# EAGLE design ESP32_Final (EAGLE 9.3.0)
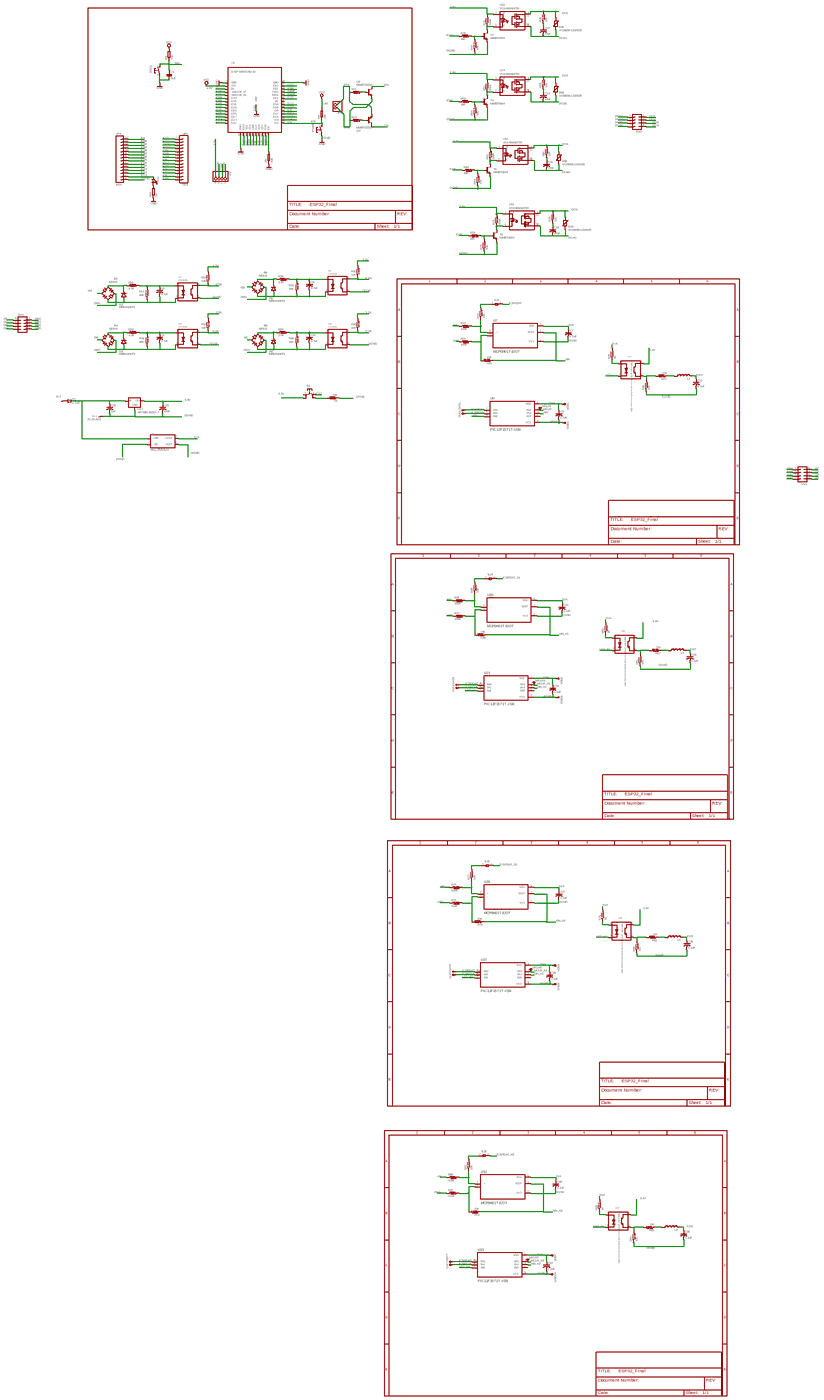
[diagram p0: schematic, sheet 1, overview]
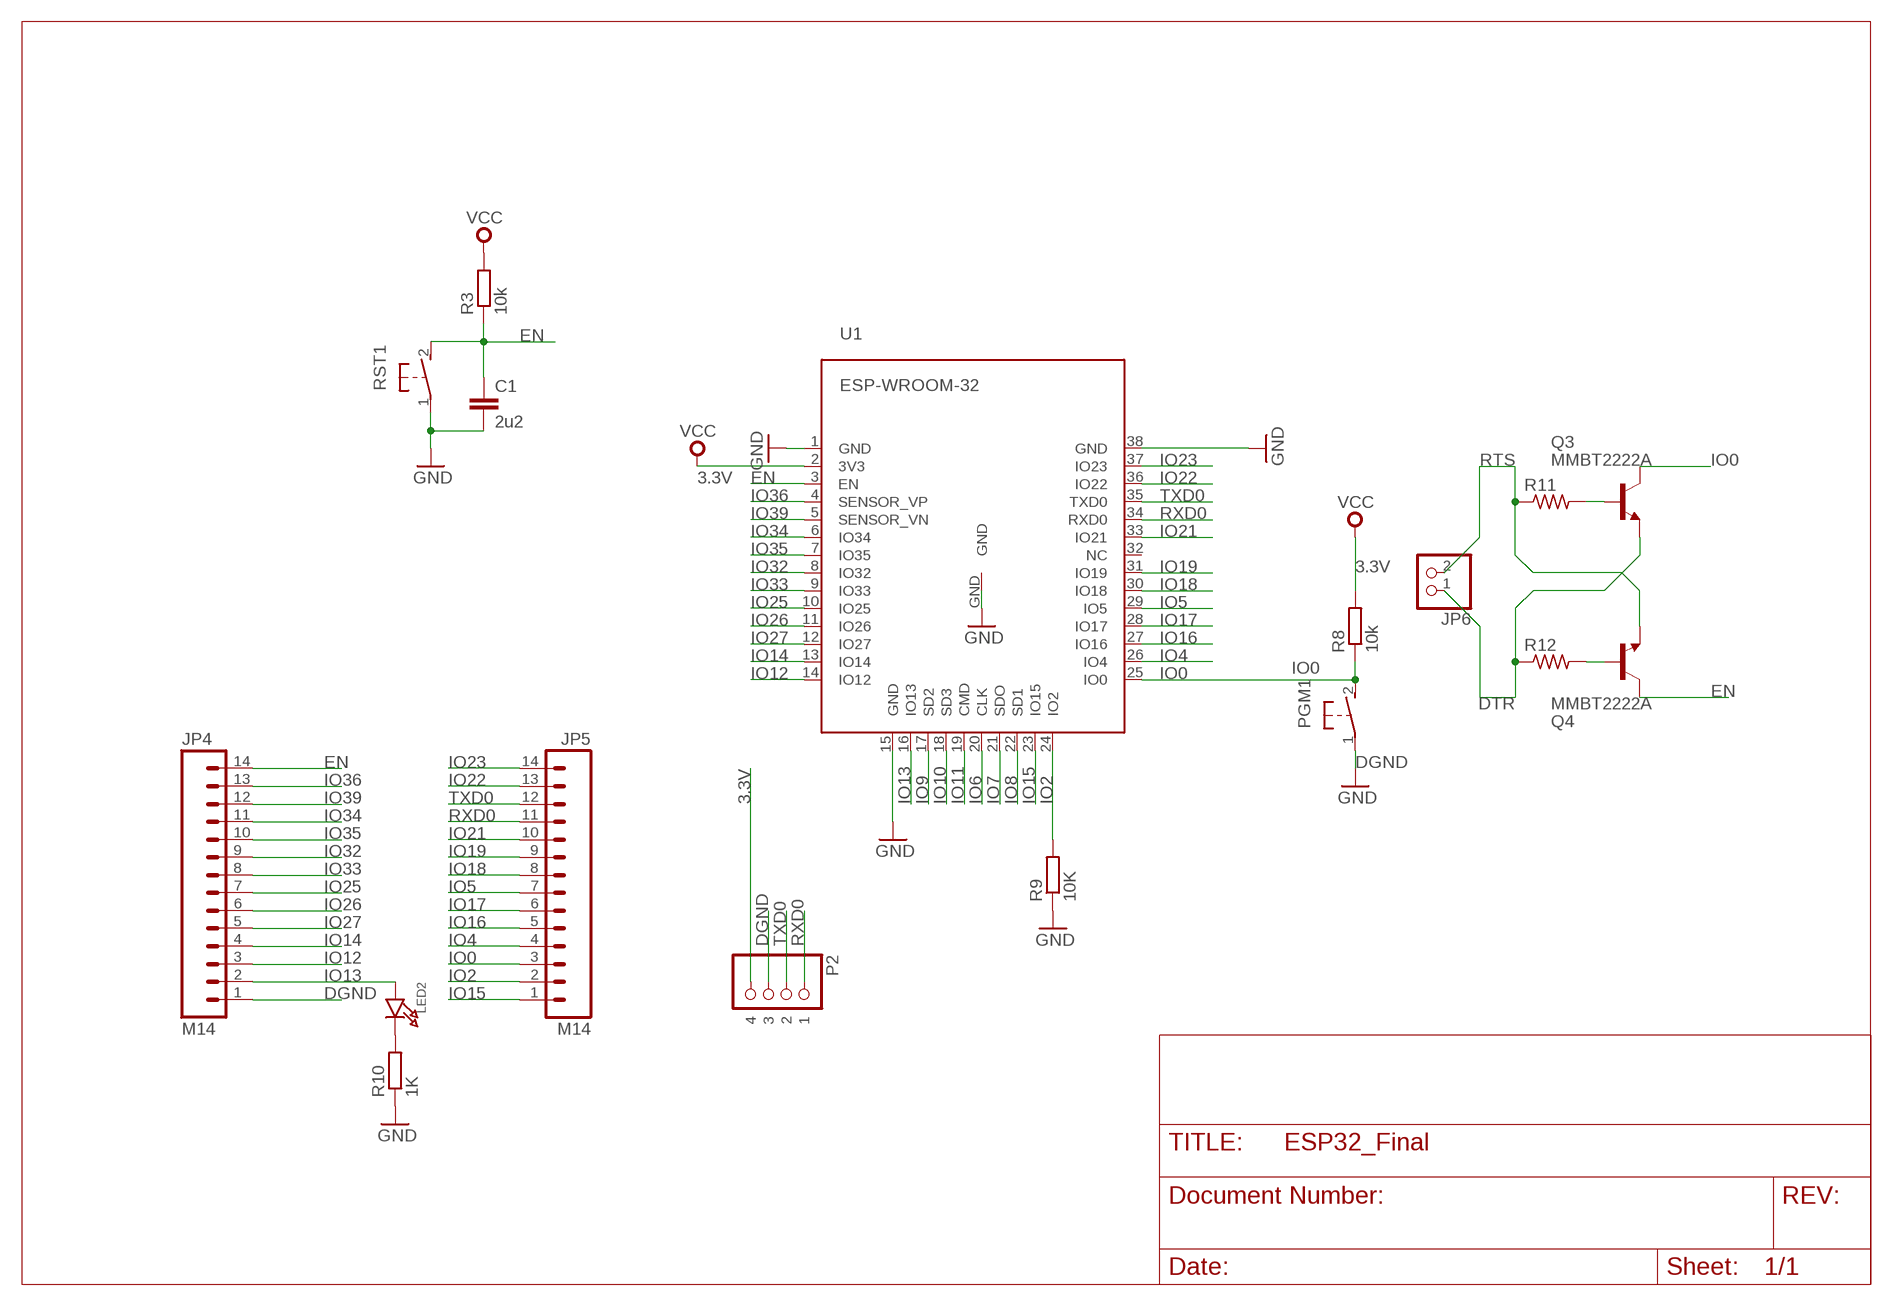
[diagram p1: schematic, sheet 1, part 1 of 5]
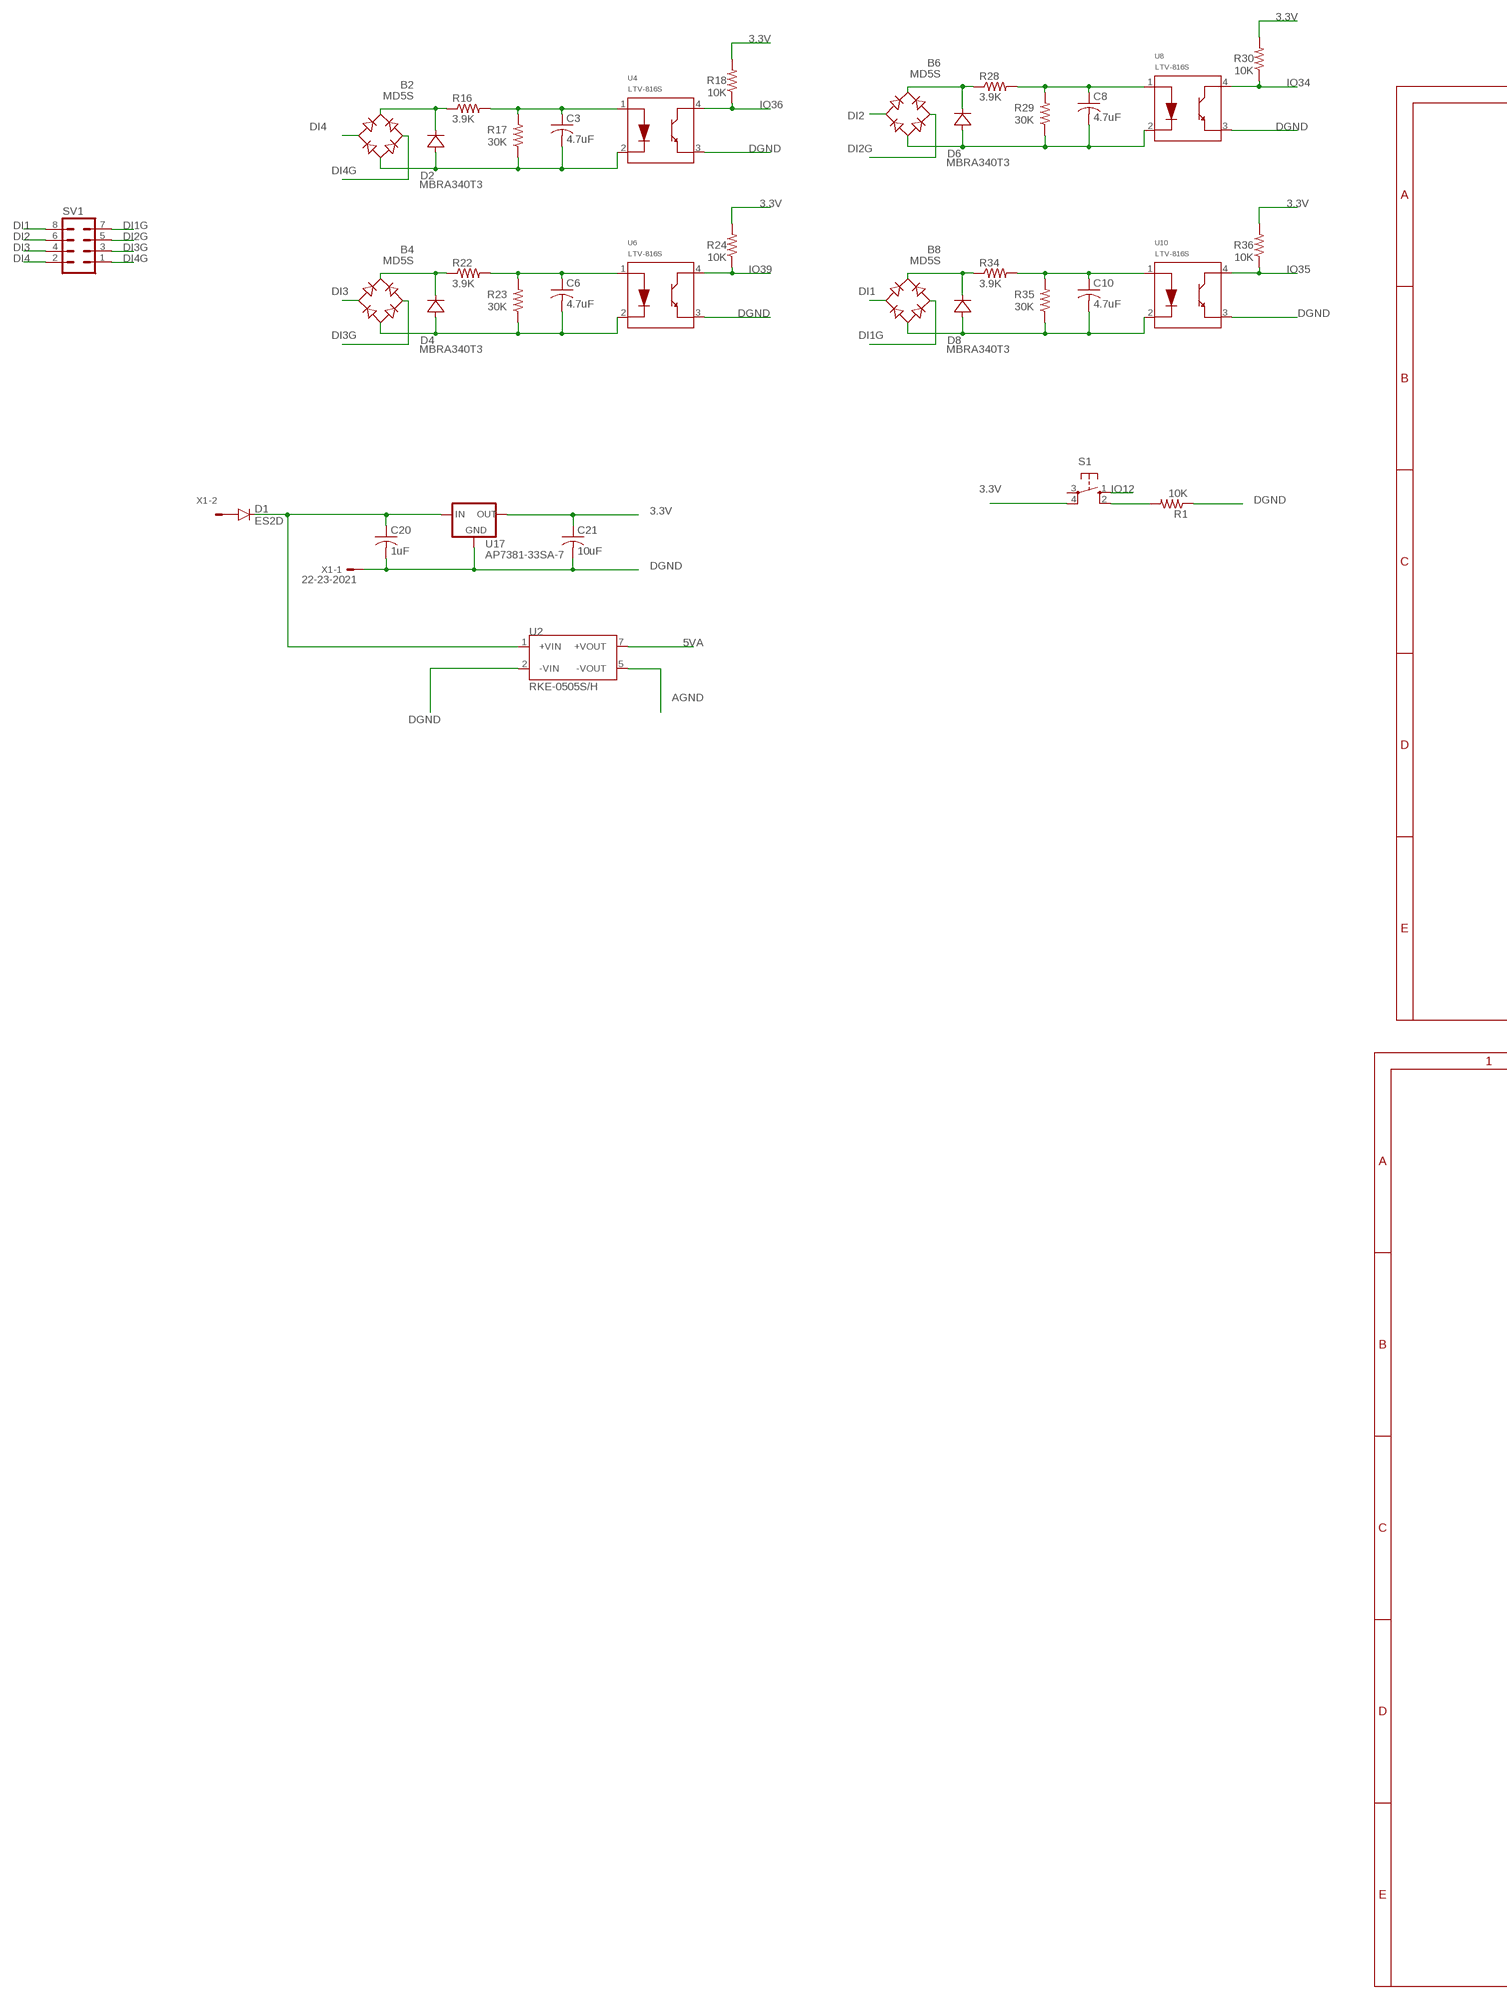
[diagram p2: schematic, sheet 1, part 2 of 5]
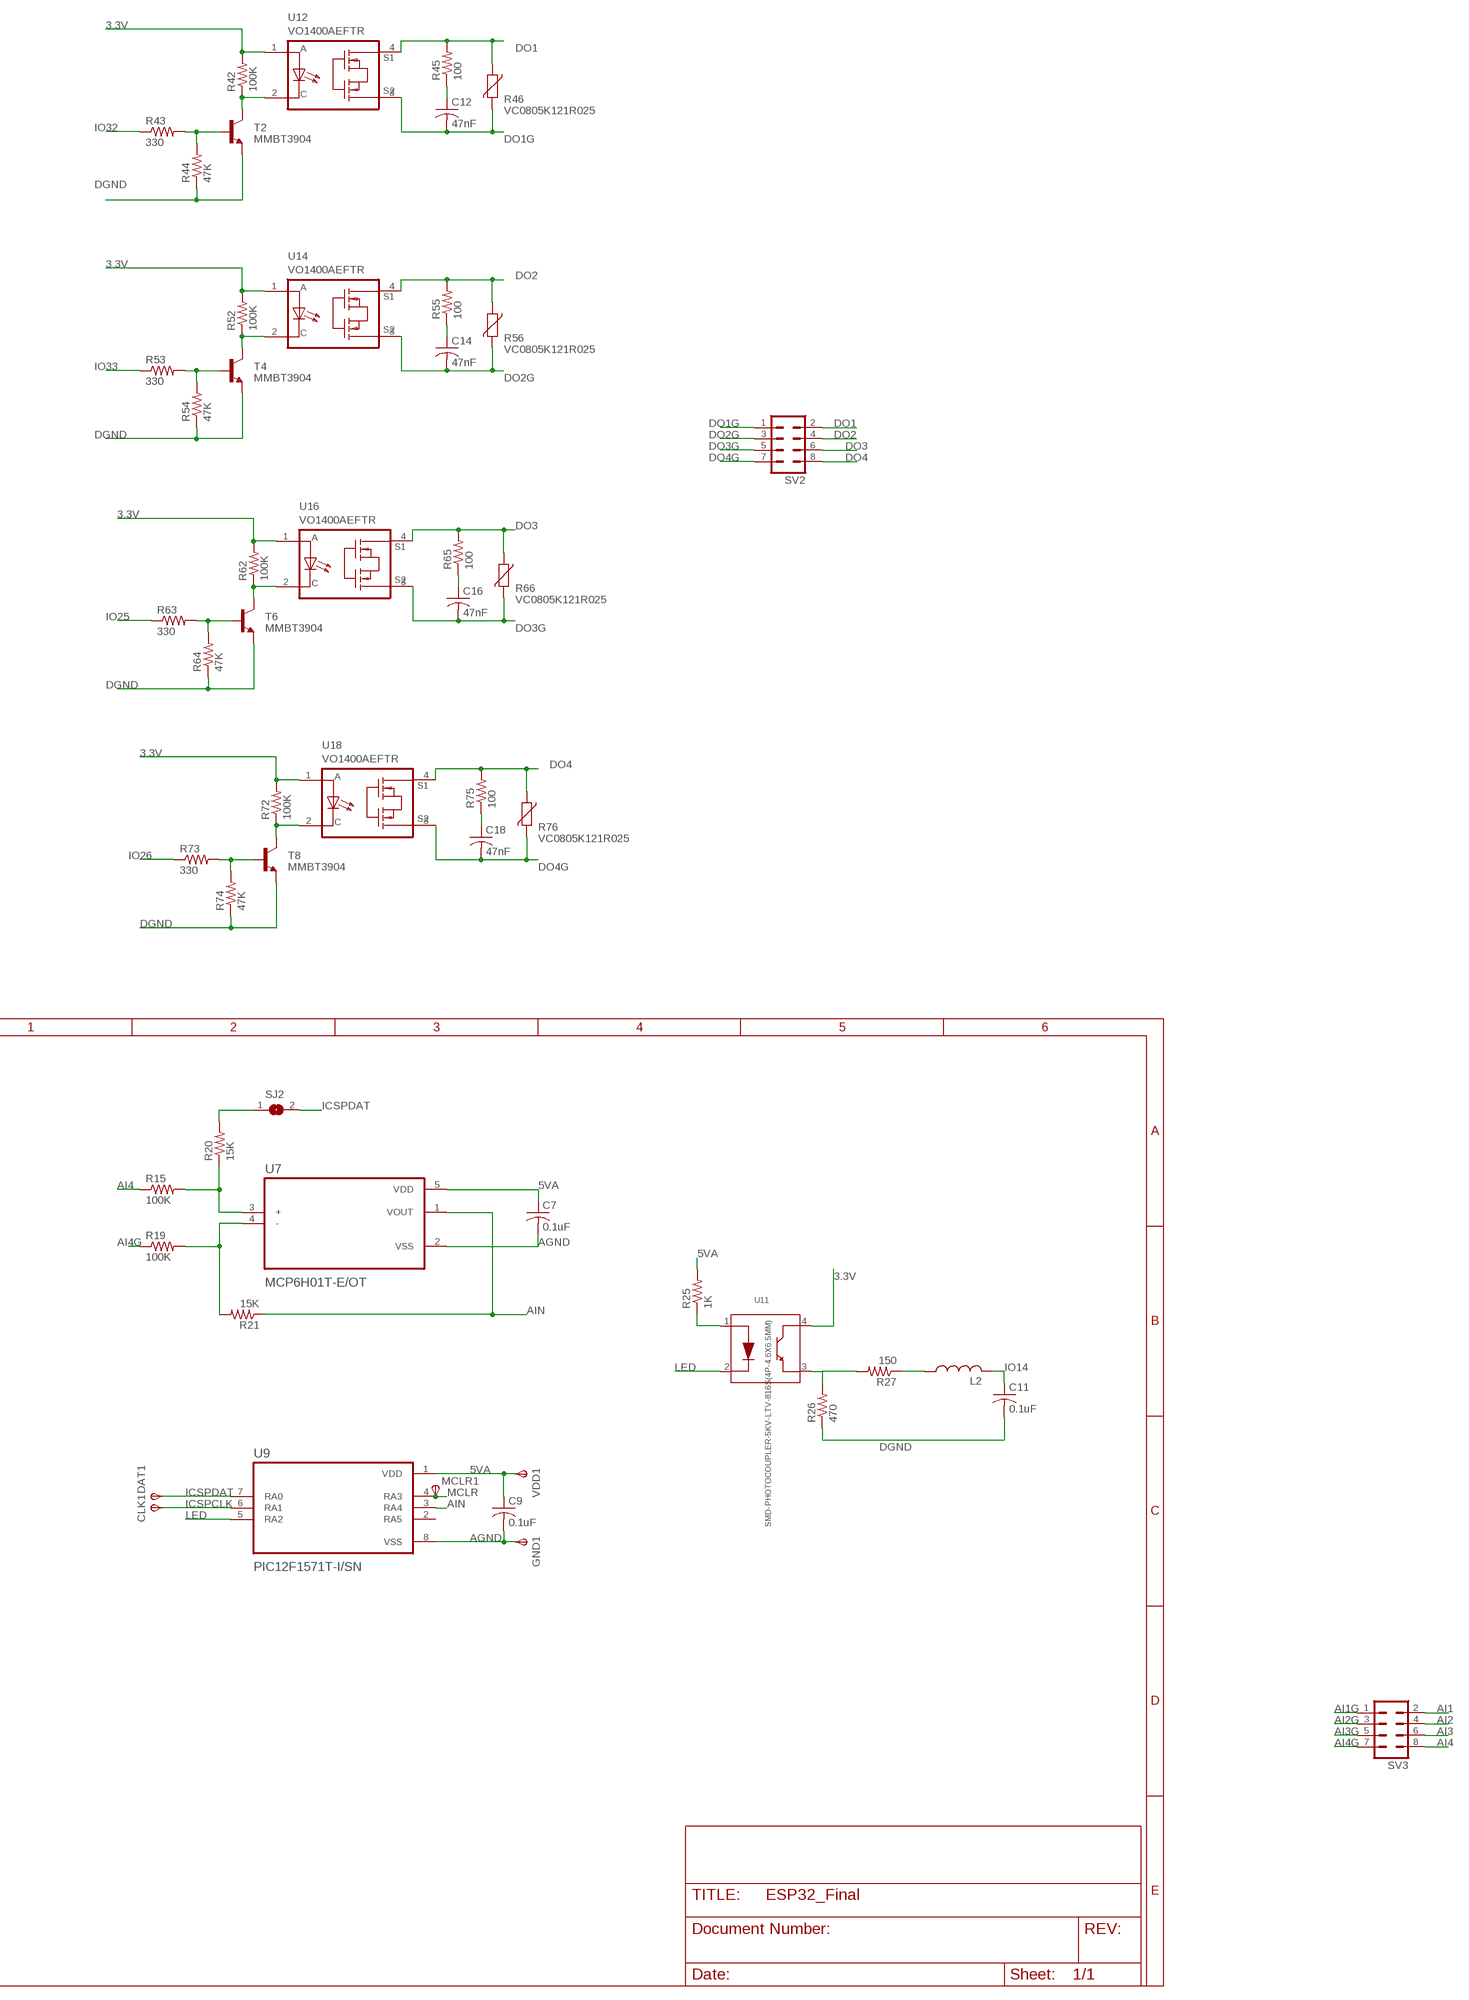
[diagram p3: schematic, sheet 1, part 3 of 5]
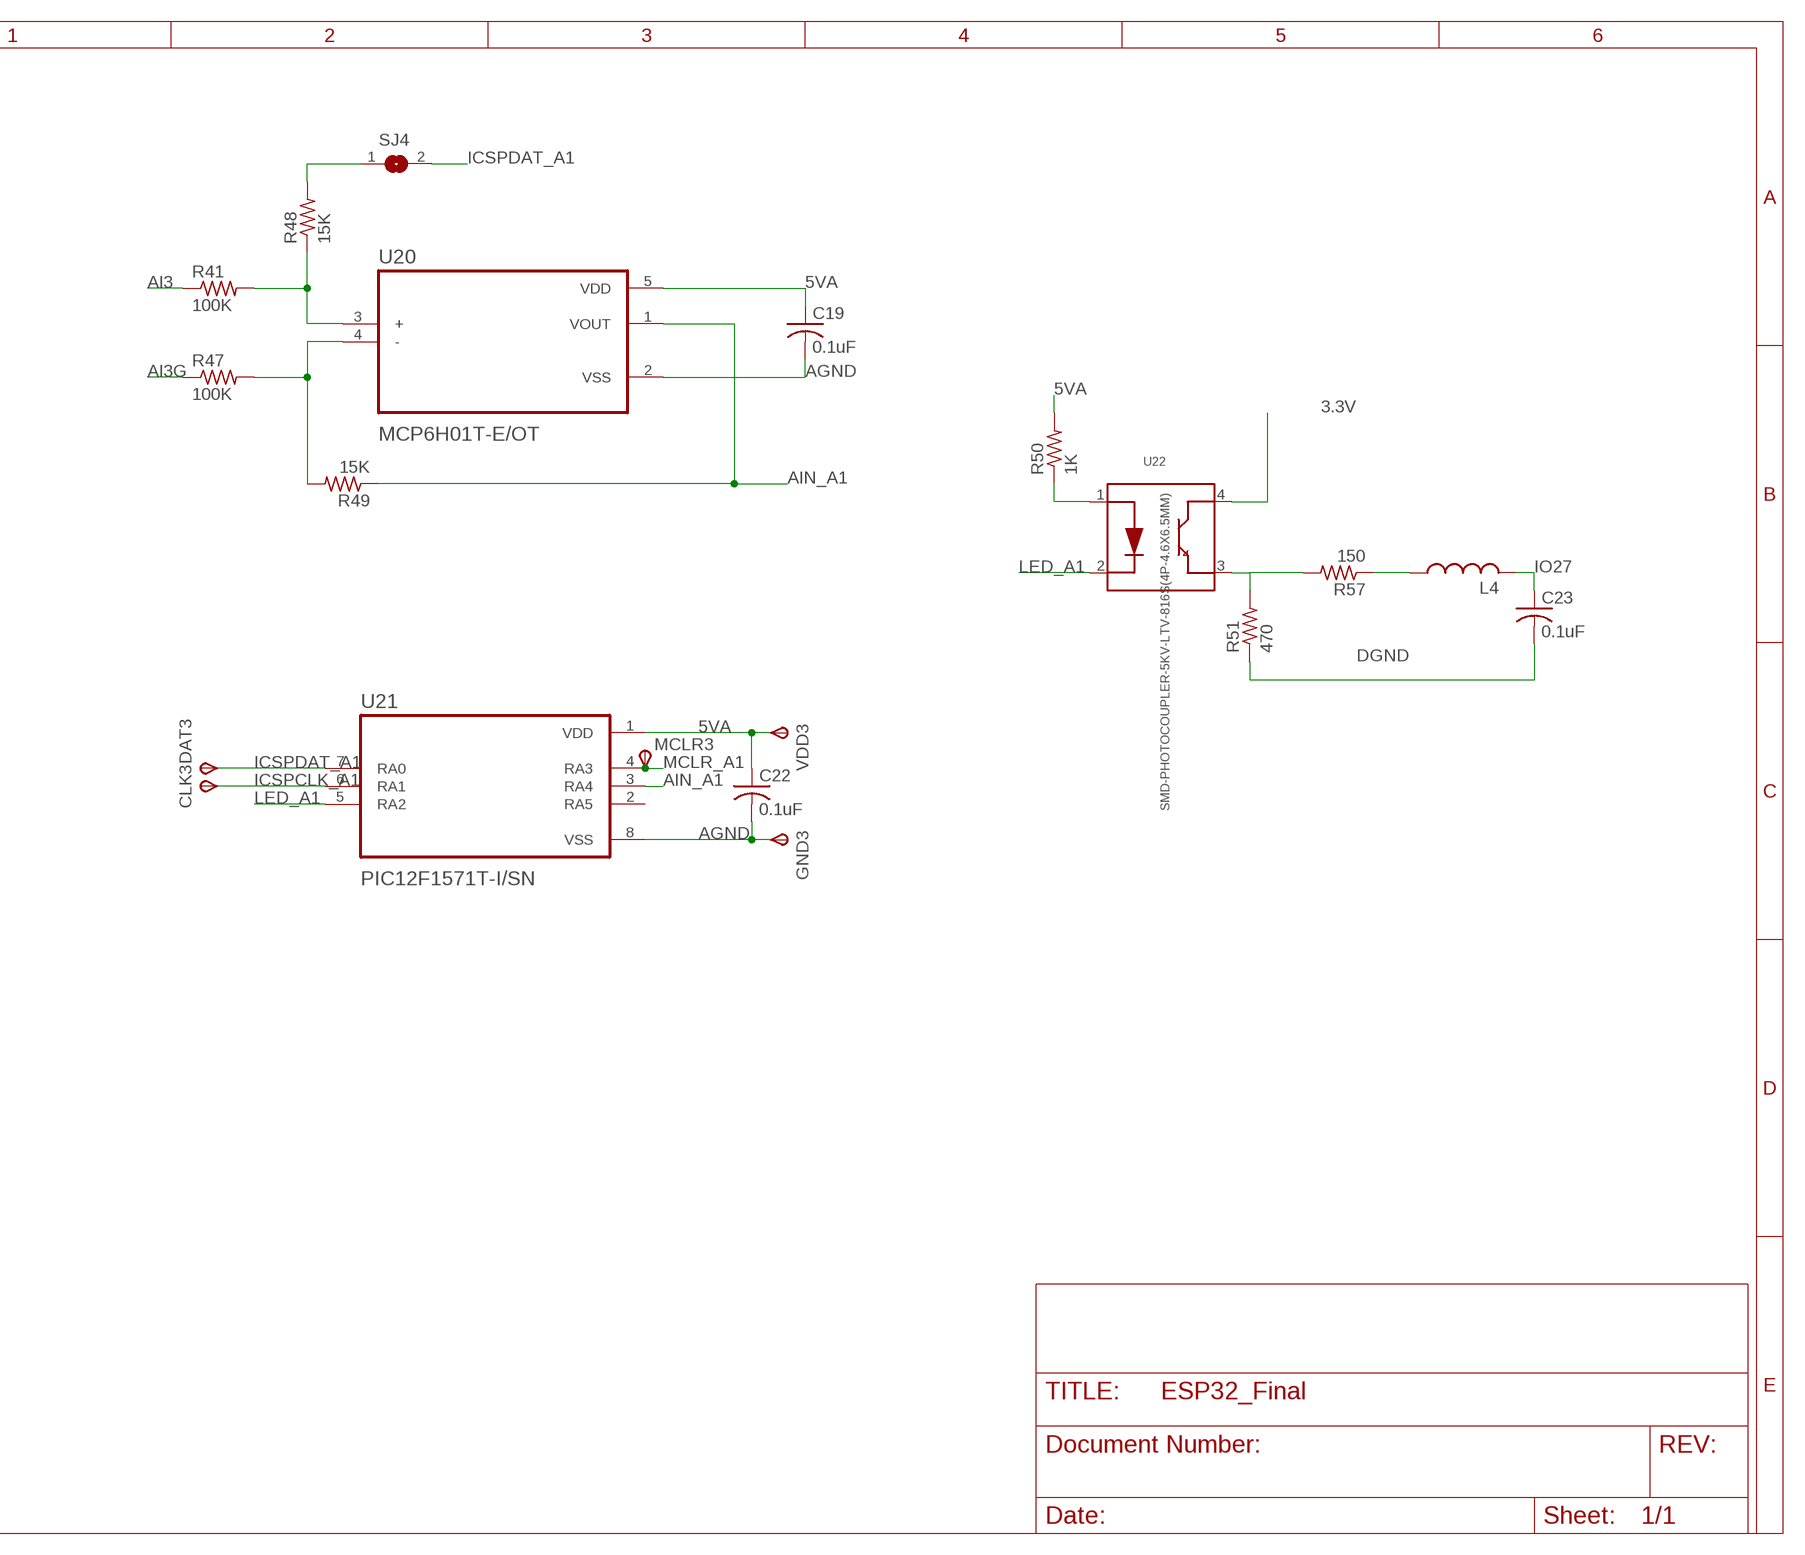
[diagram p4: schematic, sheet 1, part 4 of 5]
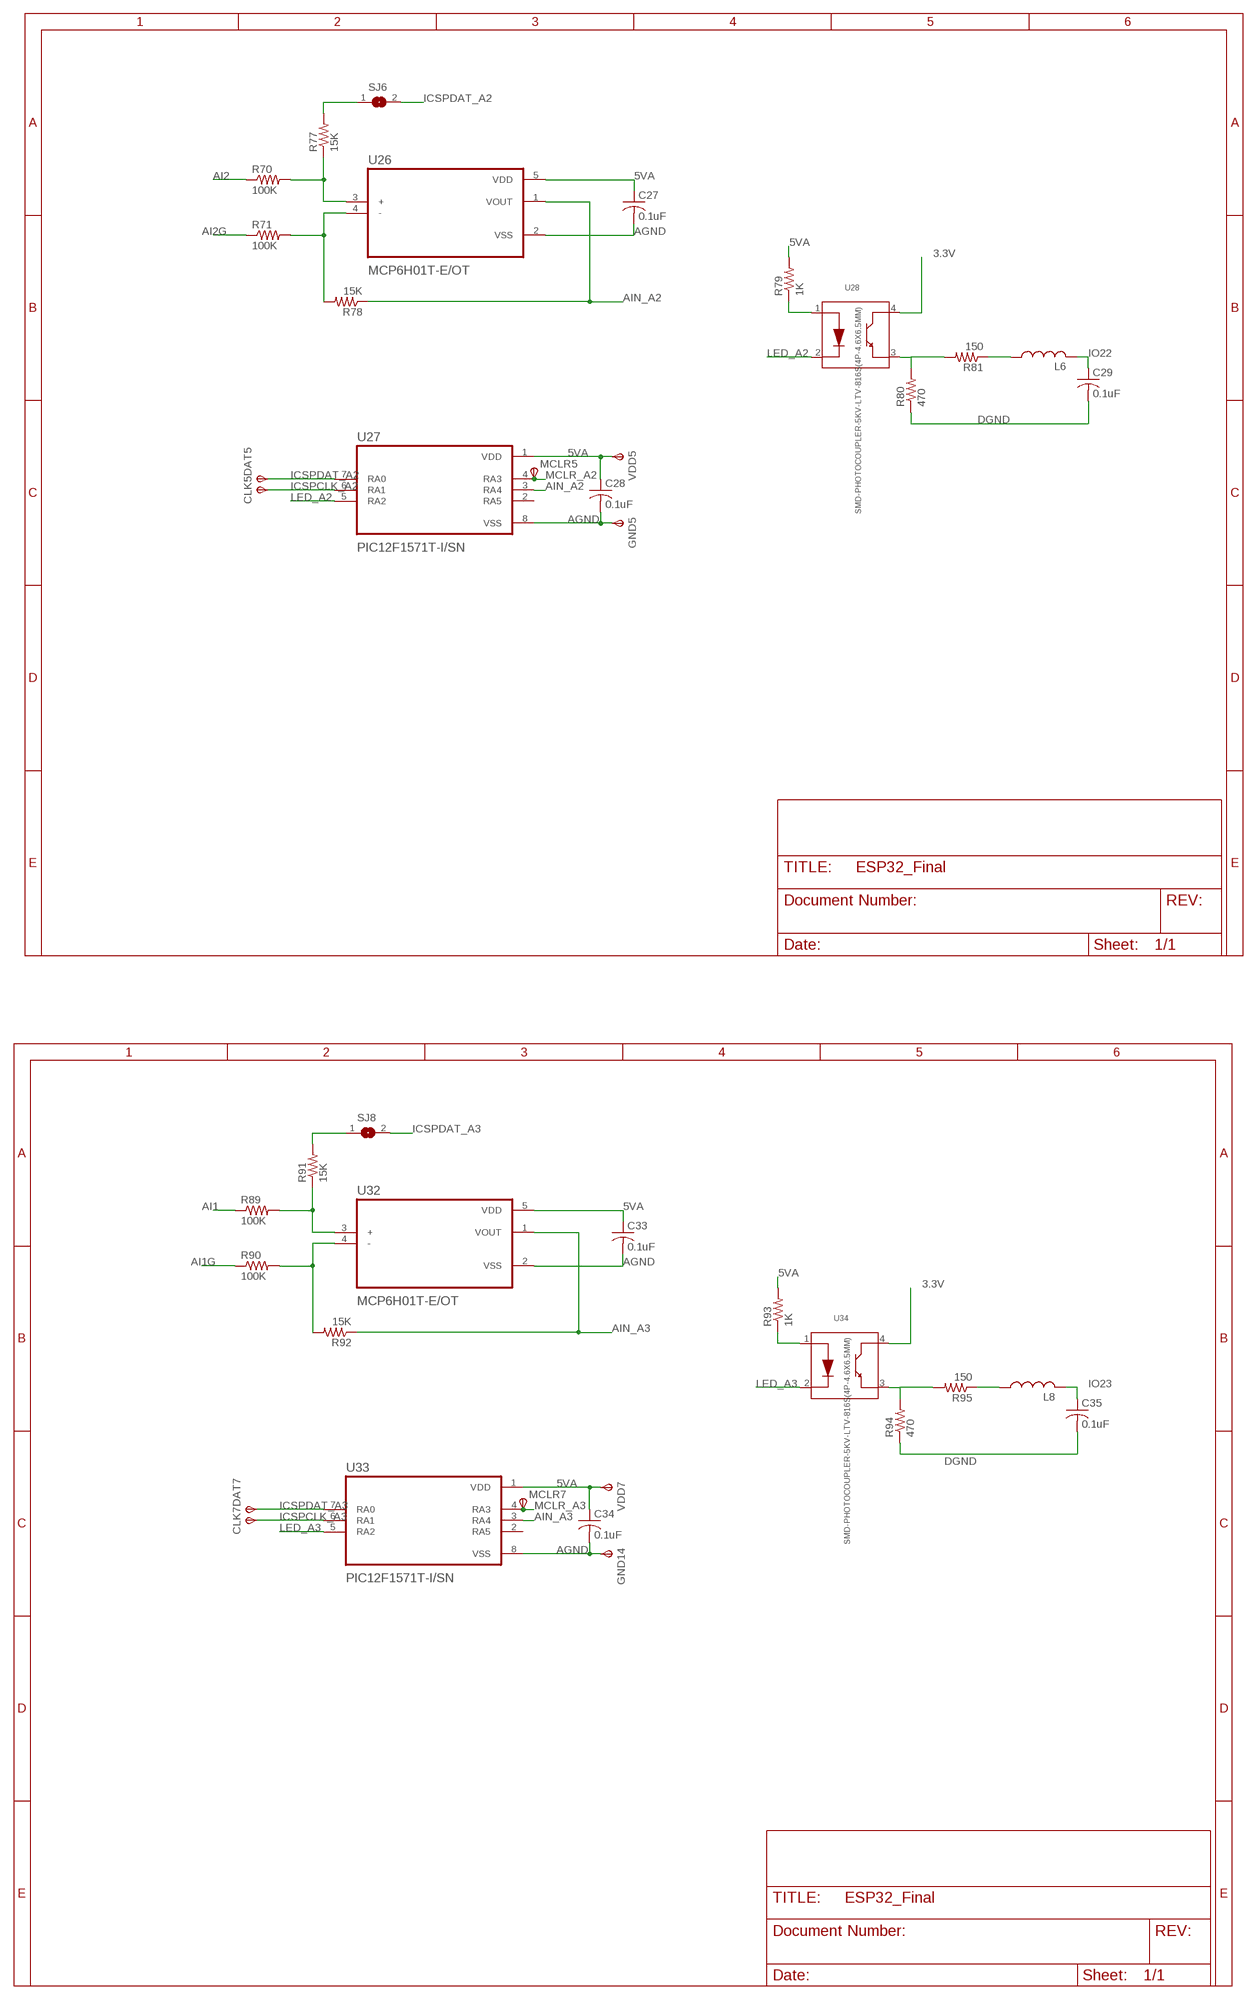
[diagram p5: schematic, sheet 1, part 5 of 5]

## Parts
B2  MD5S  RECTIFIER-S80  [TO-269AA]
B4  MD5S  RECTIFIER-S80  [TO-269AA]
B6  MD5S  RECTIFIER-S80  [TO-269AA]
B8  MD5S  RECTIFIER-S80  [TO-269AA]
C1  2u2  C-EUC0603  [C0603]
C3  4.7uF  C-USC0805  [C0805]
C6  4.7uF  C-USC0805  [C0805]
C7  0.1uF  C-USC0603  [C0603]
C8  4.7uF  C-USC0805  [C0805]
C9  0.1uF  C-USC0603  [C0603]
C10  4.7uF  C-USC0805  [C0805]
C11  0.1uF  C-USC0603  [C0603]
C12  47nF  C-USC0805  [C0805]
C14  47nF  C-USC0805  [C0805]
C16  47nF  C-USC0805  [C0805]
C18  47nF  C-USC0805  [C0805]
C19  0.1uF  C-USC0603  [C0603]
C20  1uF  C-USC0603  [C0603]
C21  10uF  C-USC0603  [C0603]
C22  0.1uF  C-USC0603  [C0603]
C23  0.1uF  C-USC0603  [C0603]
C27  0.1uF  C-USC0603  [C0603]
C28  0.1uF  C-USC0603  [C0603]
C29  0.1uF  C-USC0603  [C0603]
C33  0.1uF  C-USC0603  [C0603]
C34  0.1uF  C-USC0603  [C0603]
C35  0.1uF  C-USC0603  [C0603]
CLK1  TPSTP14R  [TP14R]
CLK3  TPSTP14R  [TP14R]
CLK5  TPSTP14R  [TP14R]
CLK7  TPSTP14R  [TP14R]
D1  ES2D  [SMB]
D2  MBRA340T3  [SMA]
D4  MBRA340T3  [SMA]
D6  MBRA340T3  [SMA]
D8  MBRA340T3  [SMA]
DAT1  TPSTP14R  [TP14R]
DAT3  TPSTP14R  [TP14R]
DAT5  TPSTP14R  [TP14R]
DAT7  TPSTP14R  [TP14R]
GND1  TPSTP14R  [TP14R]
GND3  TPSTP14R  [TP14R]
GND5  TPSTP14R  [TP14R]
GND14  TPSTP14R  [TP14R]
JP4  M14  [1X14]
JP5  M14  [1X14]
JP6  HEADER-1X2ROUND  [1X02_ROUND]
L2  L-USL2012C  [L2012C]
L4  L-USL2012C  [L2012C]
L6  L-USL2012C  [L2012C]
L8  L-USL2012C  [L2012C]
LED2  LED0603  [CHIPLED_0603]
MCLR1  TPSTP14R  [TP14R]
MCLR3  TPSTP14R  [TP14R]
MCLR5  TPSTP14R  [TP14R]
MCLR7  TPSTP14R  [TP14R]
P2  HEADER-1X4ROUND  [1X04_ROUND]
PGM1  DTSM-3  [DTSM-3]
Q3  MMBT2222A  [SOT23]
Q4  MMBT2222A  [SOT23]
R1  10K  R-US_R0805  [R0805]
R3  10k  R-EU_R0603  [R0603@1]
R8  10k  R-EU_R0603  [R0603@1]
R9  10K  R-EU_R0603  [R0603@1]
R10  1K  R-EU_R0603  [R0603@1]
R11  R-US_R0603  [R0603]
R12  R-US_R0603  [R0603]
R15  100K  R-US_R0805  [R0805]
R16  3.9K  R-US_R0805  [R0805]
R17  30K  R-US_R0805  [R0805]
R18  10K  R-US_R0603  [R0603]
R19  100K  R-US_R0805  [R0805]
R20  15K  R-US_R0603  [R0603]
R21  15K  R-US_R0603  [R0603]
R22  3.9K  R-US_R0805  [R0805]
R23  30K  R-US_R0805  [R0805]
R24  10K  R-US_R0603  [R0603]
R25  1K  R-US_R0805  [R0805]
R26  470  R-US_R0805  [R0805]
R27  150  R-US_R0805  [R0805]
R28  3.9K  R-US_R0805  [R0805]
R29  30K  R-US_R0805  [R0805]
R30  10K  R-US_R0603  [R0603]
R34  3.9K  R-US_R0805  [R0805]
R35  30K  R-US_R0805  [R0805]
R36  10K  R-US_R0603  [R0603]
R41  100K  R-US_R0805  [R0805]
R42  100K  R-US_R0603  [R0603]
R43  330  R-US_R0603  [R0603]
R44  47K  R-US_R0603  [R0603]
R45  100  R-US_R1210  [R1210]
R46  VC0805K121R025  VARISTORCN0805  [CT/CN0805]
R47  100K  R-US_R0805  [R0805]
R48  15K  R-US_R0603  [R0603]
R49  15K  R-US_R0603  [R0603]
R50  1K  R-US_R0805  [R0805]
R51  470  R-US_R0805  [R0805]
R52  100K  R-US_R0603  [R0603]
R53  330  R-US_R0603  [R0603]
R54  47K  R-US_R0603  [R0603]
R55  100  R-US_R1210  [R1210]
R56  VC0805K121R025  VARISTORCN0805  [CT/CN0805]
R57  150  R-US_R0805  [R0805]
R62  100K  R-US_R0603  [R0603]
R63  330  R-US_R0603  [R0603]
R64  47K  R-US_R0603  [R0603]
R65  100  R-US_R1210  [R1210]
R66  VC0805K121R025  VARISTORCN0805  [CT/CN0805]
R70  100K  R-US_R0805  [R0805]
R71  100K  R-US_R0805  [R0805]
R72  100K  R-US_R0603  [R0603]
R73  330  R-US_R0603  [R0603]
R74  47K  R-US_R0603  [R0603]
R75  100  R-US_R1210  [R1210]
R76  VC0805K121R025  VARISTORCN0805  [CT/CN0805]
R77  15K  R-US_R0603  [R0603]
R78  15K  R-US_R0603  [R0603]
R79  1K  R-US_R0805  [R0805]
R80  470  R-US_R0805  [R0805]
R81  150  R-US_R0805  [R0805]
R89  100K  R-US_R0805  [R0805]
R90  100K  R-US_R0805  [R0805]
R91  15K  R-US_R0603  [R0603]
R92  15K  R-US_R0603  [R0603]
R93  1K  R-US_R0805  [R0805]
R94  470  R-US_R0805  [R0805]
R95  150  R-US_R0805  [R0805]
RST1  DTSM-3  [DTSM-3]
S1  10-XX  [B3F-10XX]
SJ2  SJ  [SJ]
SJ4  SJ  [SJ]
SJ6  SJ  [SJ]
SJ8  SJ  [SJ]
SV1  MA04-2  [MA04-2]
SV2  MA04-2  [MA04-2]
SV3  MA04-2  [MA04-2]
T2  MMBT3904  MMBT3904LT1-NPN-SOT23-BEC  [SOT23-BEC]
T4  MMBT3904  MMBT3904LT1-NPN-SOT23-BEC  [SOT23-BEC]
T6  MMBT3904  MMBT3904LT1-NPN-SOT23-BEC  [SOT23-BEC]
T8  MMBT3904  MMBT3904LT1-NPN-SOT23-BEC  [SOT23-BEC]
U1  ESP-WROOM-32  [ESP-WROOM-32]
U2  RKE-0505S/H  [CONV_RKE-0505S/H]
U4  LTV-816S  SMD-PHOTOCOUPLER-5KV-LTV-816S(4P-4.6X6.5MM)  [SMD4-2.54-4.6X6.5MM]
U6  LTV-816S  SMD-PHOTOCOUPLER-5KV-LTV-816S(4P-4.6X6.5MM)  [SMD4-2.54-4.6X6.5MM]
U7  MCP6H01T-E/OT  [SOT95P280X145-5N]
U8  LTV-816S  SMD-PHOTOCOUPLER-5KV-LTV-816S(4P-4.6X6.5MM)  [SMD4-2.54-4.6X6.5MM]
U9  PIC12F1571T-I/SN  [SOIC127P600X175-8N]
U10  LTV-816S  SMD-PHOTOCOUPLER-5KV-LTV-816S(4P-4.6X6.5MM)  [SMD4-2.54-4.6X6.5MM]
U11  SMD-PHOTOCOUPLER-5KV-LTV-816S(4P-4.6X6.5MM)  [SMD4-2.54-4.6X6.5MM]
U12  VO1400AEFTR  [SOIC254P695X242-4N]
U14  VO1400AEFTR  [SOIC254P695X242-4N]
U16  VO1400AEFTR  [SOIC254P695X242-4N]
U17  AP7381-33SA-7  [SOT23]
U18  VO1400AEFTR  [SOIC254P695X242-4N]
U20  MCP6H01T-E/OT  [SOT95P280X145-5N]
U21  PIC12F1571T-I/SN  [SOIC127P600X175-8N]
U22  SMD-PHOTOCOUPLER-5KV-LTV-816S(4P-4.6X6.5MM)  [SMD4-2.54-4.6X6.5MM]
U26  MCP6H01T-E/OT  [SOT95P280X145-5N]
U27  PIC12F1571T-I/SN  [SOIC127P600X175-8N]
U28  SMD-PHOTOCOUPLER-5KV-LTV-816S(4P-4.6X6.5MM)  [SMD4-2.54-4.6X6.5MM]
U32  MCP6H01T-E/OT  [SOT95P280X145-5N]
U33  PIC12F1571T-I/SN  [SOIC127P600X175-8N]
U34  SMD-PHOTOCOUPLER-5KV-LTV-816S(4P-4.6X6.5MM)  [SMD4-2.54-4.6X6.5MM]
VDD1  TPSTP14R  [TP14R]
VDD3  TPSTP14R  [TP14R]
VDD5  TPSTP14R  [TP14R]
VDD7  TPSTP14R  [TP14R]
X1  22-23-2021  [22-23-2021]

## Nets
3.3V: C21.1 P2.4 R3.2 R8.2 R18.2 R24.2 R30.2 R36.2 R42.2 R52.2 R62.2 R72.2 S1.4(P1) U1.2(3V3) U11.4(COLLECTOR) U12.1(A) U14.1(A) U16.1(A) U17.2(OUT) U18.1(A) U22.4(COLLECTOR) U28.4(COLLECTOR) U34.4(COLLECTOR) ; supply symbol labelled VCC
5VA: C7.1 C9.1 C19.1 C22.1 C27.1 C28.1 C33.1 C34.1 R25.2 R50.2 R79.2 R93.2 U2.7(+VOUT) U7.5(VDD) U9.1(VDD) U20.5(VDD) U21.1(VDD) U26.5(VDD) U27.1(VDD) U32.5(VDD) U33.1(VDD) VDD1.TP(PP) VDD3.TP(PP) VDD5.TP(PP) VDD7.TP(PP)
AGND: C7.2 C9.2 C19.2 C22.2 C27.2 C28.2 C33.2 C34.2 GND1.TP(PP) GND3.TP(PP) GND5.TP(PP) GND14.TP(PP) U2.5(-VOUT) U7.2(VSS) U9.8(VSS) U20.2(VSS) U21.8(VSS) U26.2(VSS) U27.8(VSS) U32.2(VSS) U33.8(VSS)
AI1: R89.1 SV3.2
AI1G: R90.1 SV3.1
AI2: R70.1 SV3.4
AI2G: R71.1 SV3.3
AI3: R41.1 SV3.6
AI3G: R47.1 SV3.5
AI4: R15.1 SV3.8
AI4G: R19.1 SV3.7
AIN: R21.1 U7.1(VOUT) U9.3(RA4)
AIN_A1: R49.1 U20.1(VOUT) U21.3(RA4)
AIN_A2: R78.1 U26.1(VOUT) U27.3(RA4)
AIN_A3: R92.1 U32.1(VOUT) U33.3(RA4)
DGND: C1.2 C11.2 C20.2 C21.2 C23.2 C29.2 C35.2 JP4.1 P2.3 PGM1.1 R1.1 R9.1 R10.1 R26.1 R44.1 R51.1 R54.1 R64.1 R74.1 R80.1 R94.1 RST1.1 T2.E T4.E T6.E T8.E U1.1(GND) U1.15(GND) U1.38(GND) U1.GND U2.2(-VIN) U4.3(EMITER) U6.3(EMITER) U8.3(EMITER) U10.3(EMITER) U17.3(GND) X1.1 ; supply symbol labelled GND
DI1: B8.AC1 SV1.8
DI1G: B8.AC2 SV1.7
DI2: B6.AC1 SV1.6
DI2G: B6.AC2 SV1.5
DI3: B4.AC1 SV1.4
DI3G: B4.AC2 SV1.3
DI4: B2.AC1 SV1.2
DI4G: B2.AC2 SV1.1
DO1: R45.2 R46.1 SV2.2 U12.4(S1)
DO1G: C12.2 R46.2 SV2.1 U12.3(S2)
DO2: R55.2 R56.1 SV2.4 U14.4(S1)
DO2G: C14.2 R56.2 SV2.3 U14.3(S2)
DO3: R65.2 R66.1 SV2.6 U16.4(S1)
DO3G: C16.2 R66.2 SV2.5 U16.3(S2)
DO4: R75.2 R76.1 SV2.8 U18.4(S1)
DO4G: C18.2 R76.2 SV2.7 U18.3(S2)
DTR: JP6.1 Q3.2(E) R12.1
EN: C1.1 JP4.14 Q4.3(C) R3.1 RST1.2 U1.3(EN)
ICSPCLK: CLK1.TP(PP) U9.6(RA1)
ICSPCLK_A1: CLK3.TP(PP) U21.6(RA1)
ICSPCLK_A2: CLK5.TP(PP) U27.6(RA1)
ICSPCLK_A3: CLK7.TP(PP) U33.6(RA1)
ICSPDAT: DAT1.TP(PP) SJ2.2 U9.7(RA0)
ICSPDAT_A1: DAT3.TP(PP) SJ4.2 U21.7(RA0)
ICSPDAT_A2: DAT5.TP(PP) SJ6.2 U27.7(RA0)
ICSPDAT_A3: DAT7.TP(PP) SJ8.2 U33.7(RA0)
IO0: JP5.3 PGM1.2 Q3.3(C) R8.1 U1.25(IO0)
IO2: JP5.2 R9.2 U1.24(IO2)
IO4: JP5.4 U1.26(IO4)
IO5: JP5.7 U1.29(IO5)
IO6: U1.20(CLK)
IO7: U1.21(SDO)
IO8: U1.22(SD1)
IO9: U1.17(SD2)
IO10: U1.18(SD3)
IO11: U1.19(CMD)
IO12: JP4.3 S1.1(S) U1.14(IO12)
IO13: JP4.2 LED2.A U1.16(IO13)
IO14: C11.1 JP4.4 L2.2 U1.13(IO14)
IO15: JP5.1 U1.23(IO15)
IO16: JP5.5 U1.27(IO16)
IO17: JP5.6 U1.28(IO17)
IO18: JP5.8 U1.30(IO18)
IO19: JP5.9 U1.31(IO19)
IO21: JP5.10 U1.33(IO21)
IO22: C29.1 JP5.13 L6.2 U1.36(IO22)
IO23: C35.1 JP5.14 L8.2 U1.37(IO23)
IO25: JP4.7 R63.1 U1.10(IO25)
IO26: JP4.6 R73.1 U1.11(IO26)
IO27: C23.1 JP4.5 L4.2 U1.12(IO27)
IO32: JP4.9 R43.1 U1.8(IO32)
IO33: JP4.8 R53.1 U1.9(IO33)
IO34: JP4.11 R30.1 U1.6(IO34) U8.4(COLLECTOR)
IO35: JP4.10 R36.1 U1.7(IO35) U10.4(COLLECTOR)
IO36: JP4.13 R18.1 U1.4(SENSOR_VP) U4.4(COLLECTOR)
IO39: JP4.12 R24.1 U1.5(SENSOR_VN) U6.4(COLLECTOR)
LED: U9.5(RA2) U11.2(CATHODE)
LED_A1: U21.5(RA2) U22.2(CATHODE)
LED_A2: U27.5(RA2) U28.2(CATHODE)
LED_A3: U33.5(RA2) U34.2(CATHODE)
MCLR: MCLR1.TP(PP) U9.4(RA3)
MCLR_A1: MCLR3.TP(PP) U21.4(RA3)
MCLR_A2: MCLR5.TP(PP) U27.4(RA3)
MCLR_A3: MCLR7.TP(PP) U33.4(RA3)
N$1: LED2.C R10.2
N$2: D1.A X1.2
N$5: Q3.1(B) R11.2
N$6: Q4.1(B) R12.2
N$11: R1.2 S1.2(S1)
N$14: R15.2 R20.1 U7.3(+)
N$15: C3.1 R16.2 R17.2 U4.1(ANODE)
N$16: B2.- C3.2 D2.A R17.1 U4.2(CATHODE)
N$17: B2.+ D2.C R16.1
N$18: R19.2 R21.2 U7.4(-)
N$19: R20.2 SJ2.1
N$20: R25.1 U11.1(ANODE)
N$21: R26.2 R27.2 U11.3(EMITER)
N$24: L2.1 R27.1
N$31: C6.1 R22.2 R23.2 U6.1(ANODE)
N$32: B4.- C6.2 D4.A R23.1 U6.2(CATHODE)
N$33: B4.+ D4.C R22.1
N$40: R41.2 R48.1 U20.3(+)
N$41: R47.2 R49.2 U20.4(-)
N$42: R48.2 SJ4.1
N$43: R50.1 U22.1(ANODE)
N$44: R51.2 R57.2 U22.3(EMITER)
N$45: C20.1 D1.C U2.1(+VIN) U17.1(IN)
N$47: C8.1 R28.2 R29.2 U8.1(ANODE)
N$48: B6.- C8.2 D6.A R29.1 U8.2(CATHODE)
N$49: B6.+ D6.C R28.1
N$53: L4.1 R57.1
N$63: C10.1 R34.2 R35.2 U10.1(ANODE)
N$64: B8.- C10.2 D8.A R35.1 U10.2(CATHODE)
N$65: B8.+ D8.C R34.1
N$69: R70.2 R77.1 U26.3(+)
N$70: R71.2 R78.2 U26.4(-)
N$71: R77.2 SJ6.1
N$72: R79.1 U28.1(ANODE)
N$73: R80.2 R81.2 U28.3(EMITER)
N$76: L6.1 R81.1
N$80: R42.1 T2.C U12.2(C)
N$81: R43.2 R44.2 T2.B
N$85: C12.1 R45.1
N$92: R89.2 R91.1 U32.3(+)
N$93: R90.2 R92.2 U32.4(-)
N$94: R91.2 SJ8.1
N$95: R93.1 U34.1(ANODE)
N$96: R52.1 T4.C U14.2(C)
N$97: R53.2 R54.2 T4.B
N$98: R94.2 R95.2 U34.3(EMITER)
N$101: C14.1 R55.1
N$104: L8.1 R95.1
N$112: R62.1 T6.C U16.2(C)
N$113: R63.2 R64.2 T6.B
N$117: C16.1 R65.1
N$128: R72.1 T8.C U18.2(C)
N$129: R73.2 R74.2 T8.B
N$133: C18.1 R75.1
RTS: JP6.2 Q4.2(E) R11.1
RXD0: JP5.11 P2.1 U1.34(RXD0)
TXD0: JP5.12 P2.2 U1.35(TXD0)
Unconnected: S1.3(P) U1.32(NC) U9.2(RA5) U21.2(RA5) U27.2(RA5) U33.2(RA5)

## Library data of the parts
B2 B4 B6 B8 = rectifier:RECTIFIER-: Rectifier
C1 = rcl:C-EU: CAPACITOR, European symbol
C3 C6-C12 C14 C16 C18-C23 C27-C29 C33-C35 = rcl:C-US: CAPACITOR, American symbol; SPICEPREFIX: C
CLK1 CLK3 CLK5 CLK7 DAT1 DAT3 DAT5 DAT7 GND1 GND3 GND5 GND14 MCLR1 MCLR3 MCLR5 MCLR7 VDD1 VDD3 VDD5 VDD7 = testpad:TPS: TEST PIN
D1 = diode:ES2D: DIODE super fast rectifier, 2 A
D2 D4 D6 D8 = diode:MBRA340T3: Surface Mount Schottky Power Rectifier Source: http://www.onsemi.com/pub_link/Collateral/MBRA340T3-D.PDF
JP4 JP5 = SparkFun-Connectors:M14: Header 14 Standard 14-pin 0.1" header. Use with straight break away headers (SKU : PRT-00116), right angle break away headers (PRT-00553), swiss pins (PRT-00743), machine pins (PRT-00117), and female headers (PRT-00115).
JP6 = hari:HEADER-1X2: PIN HEADER
L2 L4 L6 L8 = rcl:L-US: INDUCTOR, American symbol; SPICEPREFIX: L
LED2 = hari:LED: LED 0603 - 0603 Surface Mount Package Green LED - Low Power (3.9mcd, 2ma, 1.7Vf) Orange LED - Low Power (9.8mcd, 2ma, 1.8Vf) Red LED - Low Power (5mcd, 2ma, 1.8Vf) Yellow LED - Low Power (7mcd, 2ma, 1.8Vf) 0805 - 0805 Surface Mount Package 20mA: Red LED (104mcd, 20mA, Diffused) - LS R976 [Digikey: 475-1278-6-ND] Red LED (12mcd, 20mA, 2.0Vf, Clear) - APT2012EC [Digikey: 754-1128-1-ND] Green LED (15mcd, 20mA, 2.2Vf, Clear) - APT2012GC [Digikey: 754-1131-1-ND] Orange LED (160mcd, 20mA, 2.1Vf, Clear) - APT2012SECK [Digikey: 754-1130-1-ND] 2mA: Red LED (8.8mcd, 2mA, 1.8Vf, Clear) - Low Power [Digikey: 475-2510-1-ND] Green LED (5mcd, 2mA, 1.8Vf, Clear) - Low Power [Digikey: 475-2730-1-ND] Yellow LED (11.3mcd, 2mA, 1.8Vf, Clear) - Low Power [Digikey: 475-2555-1-ND] 1206 - 1206 Surface Mount Package Green LED (26mcd, 20mA, Diffused) - LG N971 [Digikey: 475-1407-6-ND] Red LED (15mcd, 20mA, Diffused) - LH N974 [Digikey: 475-1416-6-ND]
P2 = hari:HEADER-1X4: PIN HEADER
PGM1 RST1 = switch-tact:DTSM-3
Q3 Q4 = MMBT2222A:MMBT2222A: 2N2222 General Purpose NPN Transistor; AVAILABILITY: Unavailable; MF: STMicroelectronics; MP: MMBT2222A; PACKAGE: TO-236-3 Taitron; PRICE: None
R1 R11 R12 R15-R17 R19-R23 R25-R29 R34 R35 R41-R45 R47-R55 R57 R62-R65 R70-R75 R77-R81 R89-R95 = rcl:R-US_: RESISTOR, American symbol; SPICEPREFIX: R
R3 R8-R10 = rcl:R-EU_: RESISTOR, European symbol
R18 R24 R30 R36 = rcl:R-US_: RESISTOR, American symbol
R46 R56 R66 R76 = varistor:VARISTOR: VARISTOR
S1 = switch-omron:10-XX: OMRON SWITCH; MPN: B3F-1000; OC_FARNELL: 176432; OC_NEWARK: 36M3542
SJ2 SJ4 SJ6 SJ8 = jumper:SJ: SMD solder JUMPER
SV1-SV3 = con-lstb:MA04-2: PIN HEADER; OC_FARNELL: unknown; OC_NEWARK: unknown
T2 T4 T6 T8 = transistor:*-NPN-: NPN Transistror BF959 corrected 2008.03.06
U1 = esp32:ESP-WROOM-32
U2 = RKE-0505S_H:RKE-0505S/H: Power Supply; DC-DC; 5V@0.2A; 4.5-5.5V In; Enclosed; PCB Mount; RKE-0505S/H Series; AVAILABILITY: Unavailable; DESCRIPTION: Power Supply; DC-DC; 5V@0.2A; 4.5-5.5V In; Enclosed; PCB Mount; RKE-0505S/H Series; MF: Recom Power; MP: RKE-0505S/H; PACKAGE: SIP-7 Recom Power; PRICE: None
U4 U6 U8 U10 U11 U22 U28 U34 = LTV-816S:SMD-PHOTOCOUPLER-5KV-LTV-816S(4P-4.6X6.5MM): 306060007; AVAILABILITY: Unavailable; DESCRIPTION: LTV Series Single Channel 80 V 5000 Vrms Transistor Output Optocoupler SMT-DIP-4; MF: Lite-On Inc.; MP: LTV-816S; PACKAGE: SMD-4 Lite-On; PRICE: None
U7 U20 U26 U32 = MCP6H01T-E_OT:MCP6H01T-E/OT: None; AVAILABILITY: Unavailable; DESCRIPTION: Operational amplifier; 1.2MHz; 3.5÷16VDC; Channels: 1; SOT23-5; MF: Microchip; MP: MCP6H01T-E/OT; PACKAGE: SOT-23 Microchip; PRICE: None
U9 U21 U27 U33 = PIC12F1571T-I_SN:PIC12F1571T-I/SN: None; AVAILABILITY: Unavailable; DESCRIPTION: PIC12F Series 1.75 kB Flash 128 Byte SRAM SMT 8-Bit Microcontroller - SOIC-8; MF: Microchip; MP: PIC12F1571T-I/SN; PACKAGE: SOIC-8 Microchip; PRICE: None
U12 U14 U16 U18 = VO1400AEFTR:VO1400AEFTR; AVAILABILITY: Unavailable; DESCRIPTION: VO1400 Series SPST 60 V 100 mA 5 Ohm 1 Form A Solid State Relay - SOIC-4; MF: Vishay; MP: VO1400AEFTR; PACKAGE: SOP-4 Vishay; PRICE: None
U17 = v-reg:AP7381-33SA-7
X1 = con-molex:22-23-2021: .100" (2.54mm) Center Header - 2 Pin; MF: MOLEX; MPN: 22-23-2021; OC_FARNELL: 1462926; OC_NEWARK: 25C3832

## Net classes
0 default: width 0.152 mm, drill 0.508 mm, clearance 0.254 mm
2 vcc: width 0.152 mm, drill 0.406 mm, clearance 0.254 mm

## Board
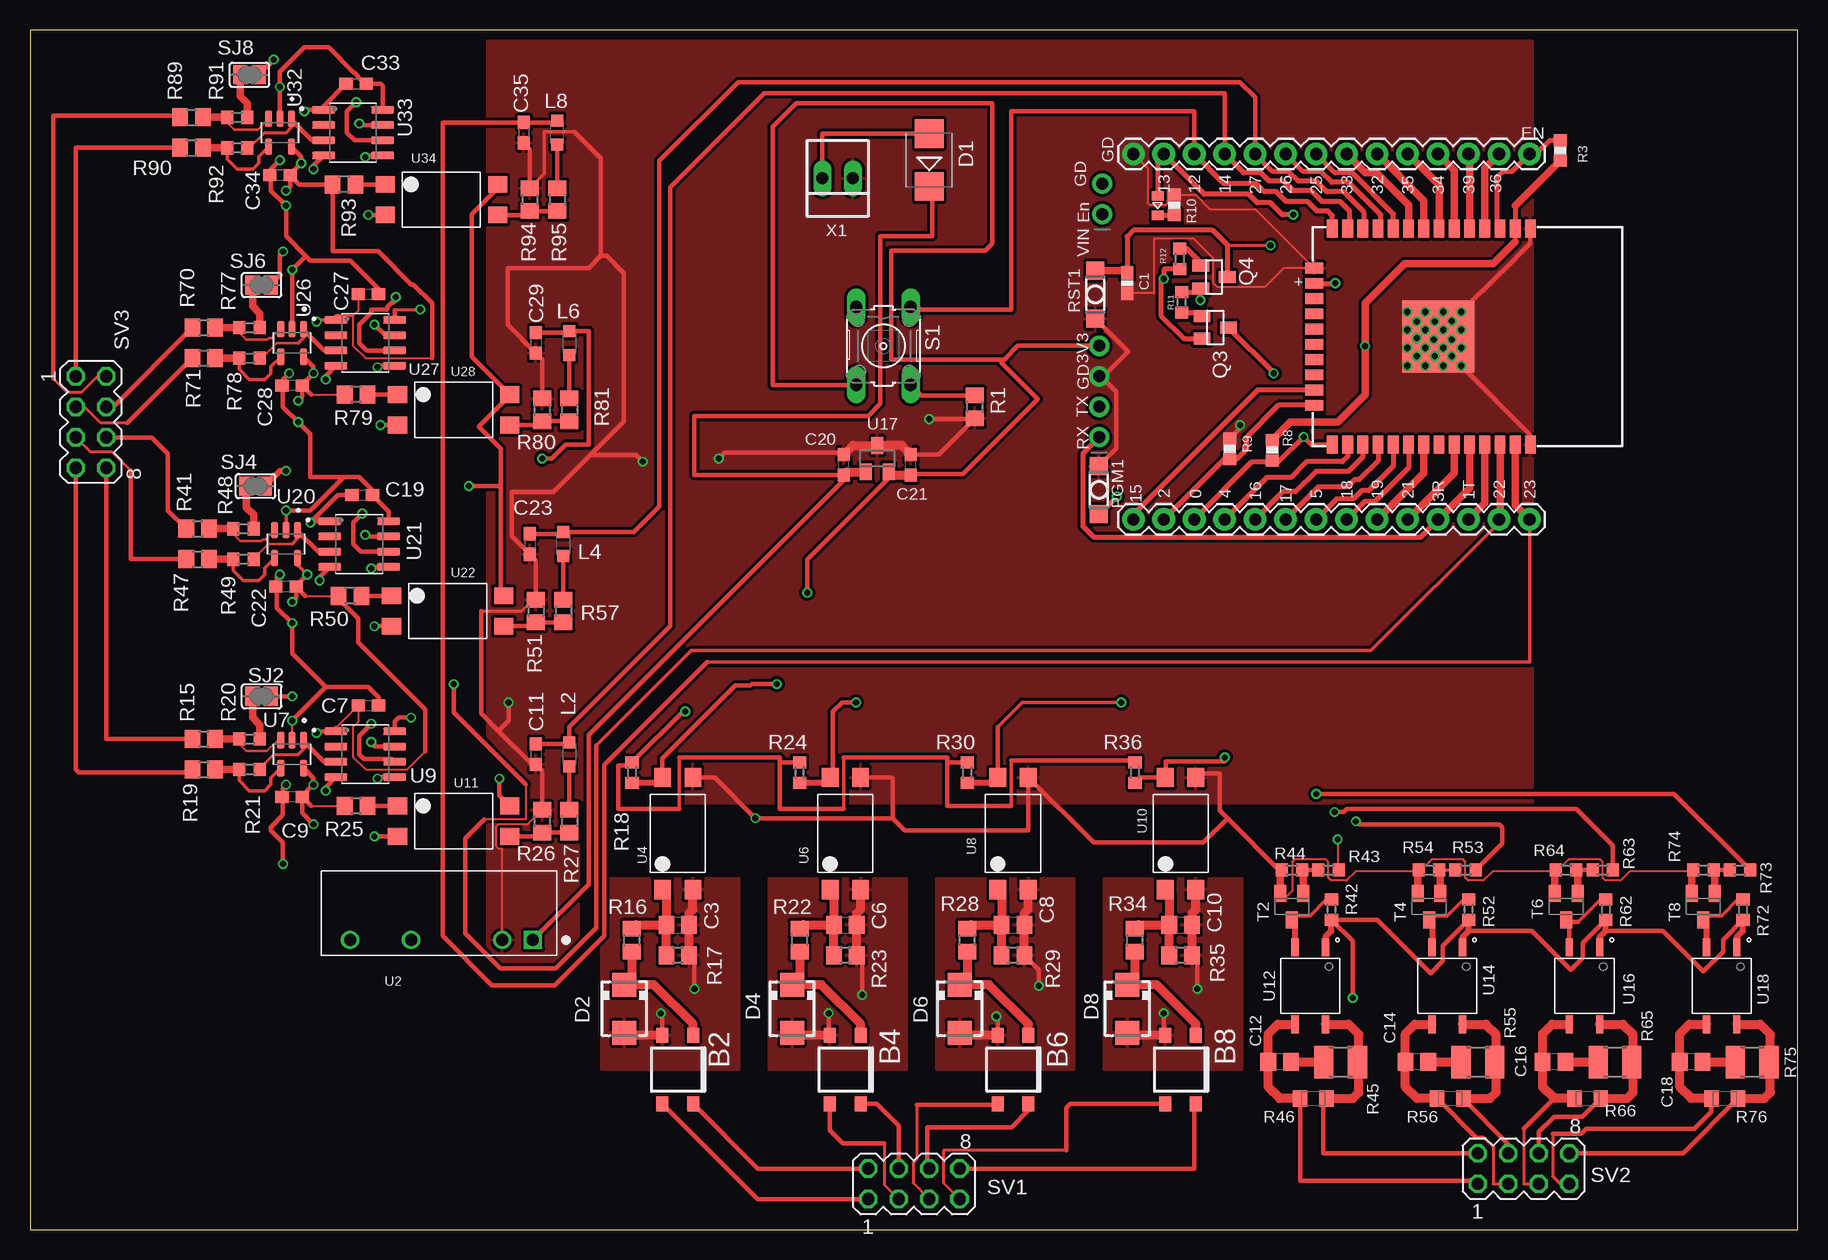
[diagram p6: board, top side]
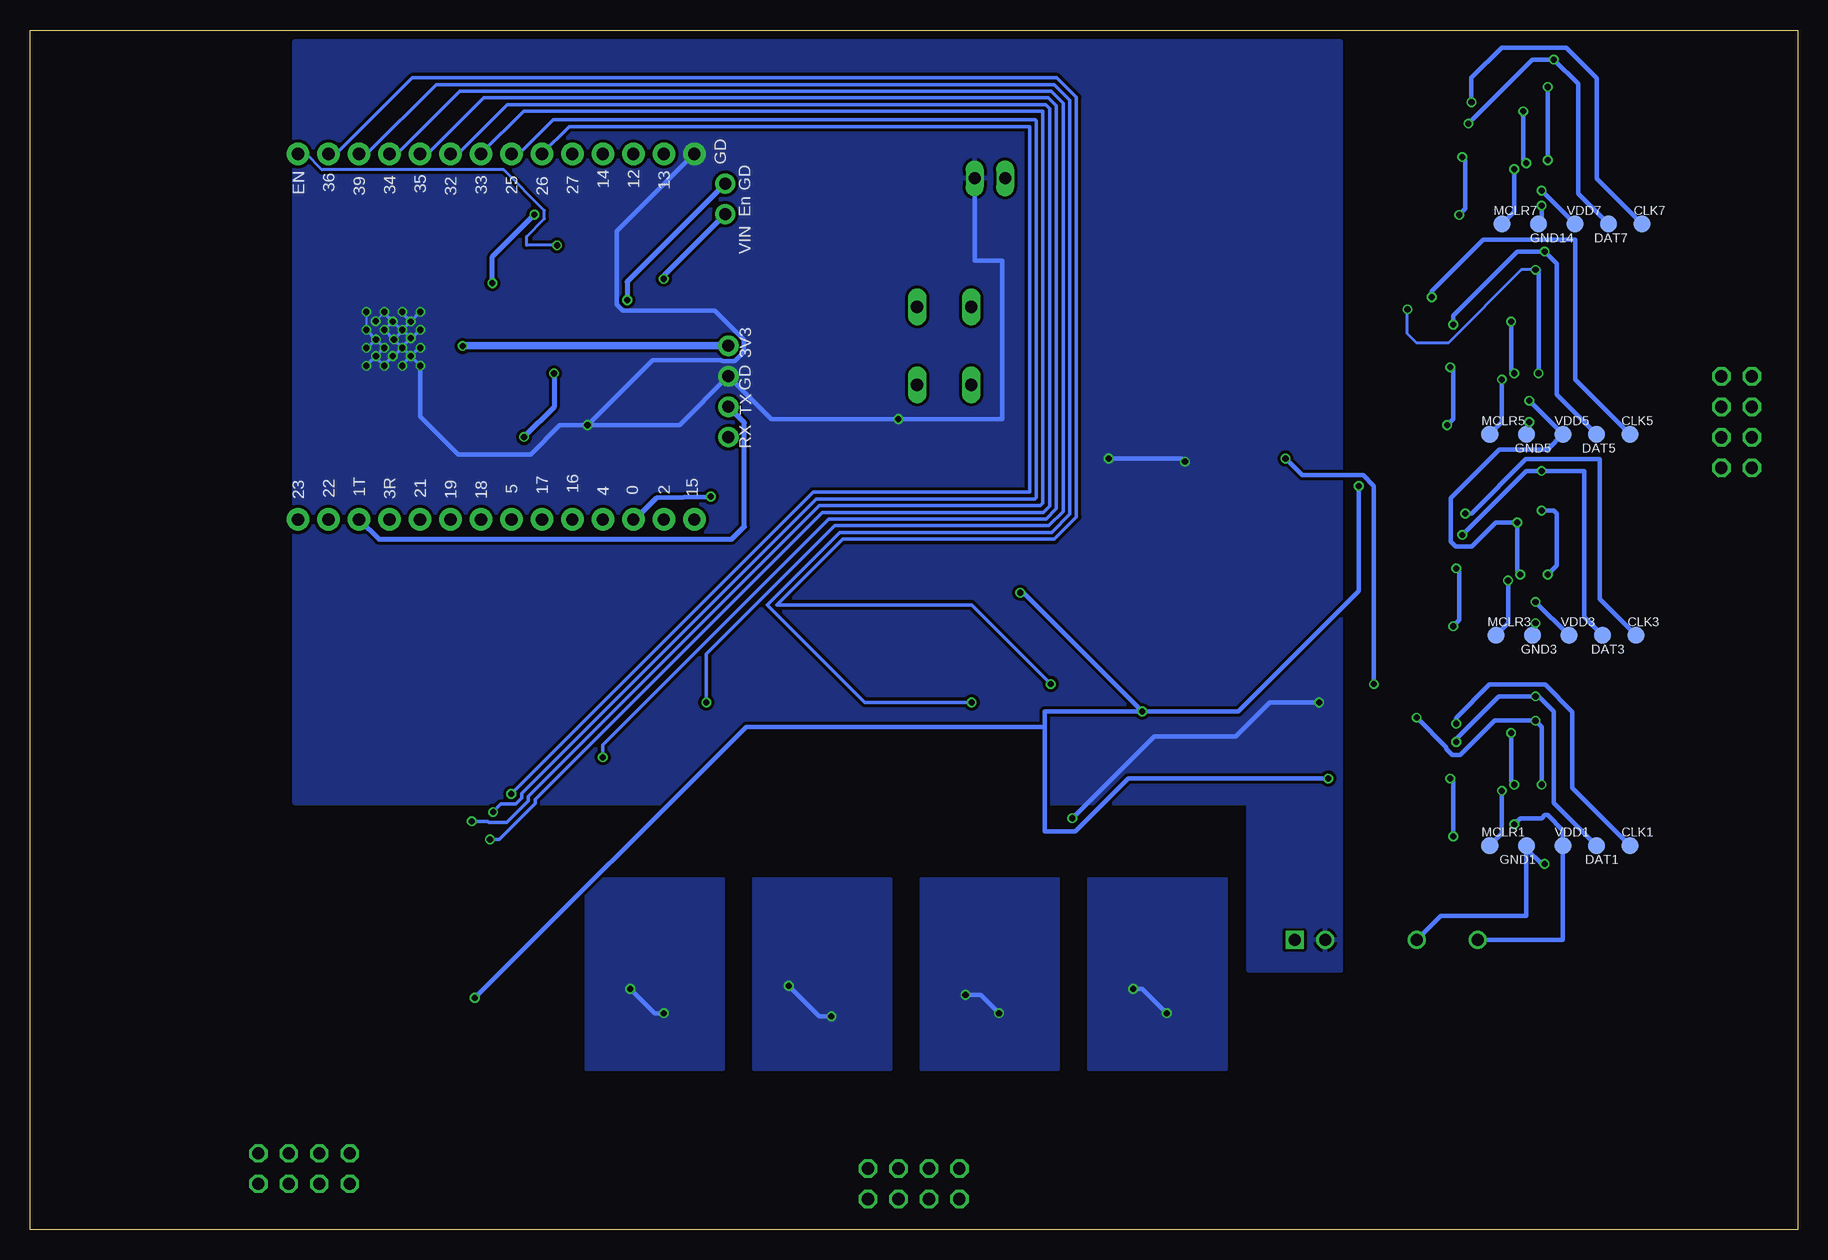
[diagram p7: board, bottom side, seen from below]

Size 147.3 x 100 mm. Coordinates in mm from the lower left corner, seen from the top.
Outline: 0,0 147.3,0 147.3,100 0,100 0,0
Copper layers (1*16): Top 0.035mm / dielectric 1.5mm / Bottom 0.035mm
Design rules "SeeedStudio_2layer_DRU_no_angle_20140221": minimum track width 6mil, minimum drill 12mil, track to track 6mil, track to pad 6mil, pad to pad 6mil, via to via 6mil, smd to smd 0mil, copper to edge 10mil, drill to drill 10mil, minimum pad ring 10mil, minimum via ring 6mil, stop-mask expansion 2mil, vias tented up to drill 100mil, thermal gap 10mil

### Footprints (pad centres in the part's own frame; a part is rotated, then mirrored left to right if it is on the bottom)
TO-269AA = smd 1 x 1.25: + -1.28,-2.855; - 1.28,-2.855; AC1 -1.28,2.855; AC2 1.28,2.855
C0603 = smd 1.1 x 1: 1 -0.85,0; 2 0.85,0
C0805 = smd 1.3 x 1.5: 1 -0.95,0; 2 0.95,0
TP14R = smd 1.4 x 1.4: TP 0,0
SMB = smd 2.4 x 2.4: A 2.2,0; C -2.2,0
SMA = smd 2 x 2: A 2,0; C -2,0
1X14 = drill 1.016 pad 1.88: 1 0,0; 2 2.54,0; 3 5.08,0; 4 7.62,0; 5 10.16,0; 6 12.7,0; 7 15.24,0; 8 17.78,0; 9 20.32,0; 10 22.86,0; 11 25.4,0; 12 27.94,0; 13 30.48,0; 14 33.02,0
1X02_ROUND = drill 1 pad 1.676: 1 -1.27,0; 2 1.27,0
L2012C = smd 1 x 1: 1 -1,0; 2 1,0
CHIPLED_0603 = smd 1.016 x 0.8: A 0,-0.75; C 0,0.85
1X04_ROUND = drill 1 pad 1.676: 1 -3.81,0; 2 -1.27,0; 3 1.27,0; 4 3.81,0
DTSM-3 = smd 1.5 x 1.5: 1 -2,0; 2 2,0
SOT23 = smd 1 x 1.4: 1 -0.95,-1.1; 2 0.95,-1.1; 3 0,1.1
R0805 = smd 1.3 x 1.5: 1 -0.95,0; 2 0.95,0
R0603@1 = smd 1 x 1.1: 1 -0.85,0; 2 0.85,0
R0603 = smd 1 x 1.1: 1 -0.85,0; 2 0.85,0
R1210 = smd 1.6 x 2.7: 1 -1.4,0; 2 1.4,0
CT/CN0805 = smd 1.2 x 1.4: 1 -1.1,0; 2 1.1,0
B3F-10XX = drill 1.016 long: 1 -3.251,2.261; 2 3.251,2.261; 3 -3.251,-2.261; 4 3.251,-2.261
SJ = smd 1.168 x 1.6: 1 -0.762,0; 2 0.762,0
MA04-2 = drill 1.016 octagon: 1 -3.81,-1.27; 2 -3.81,1.27; 3 -1.27,-1.27; 4 -1.27,1.27; 5 1.27,-1.27; 6 1.27,1.27; 7 3.81,-1.27; 8 3.81,1.27
SOT23-BEC = smd 1 x 1.4: B -0.95,-1.1; C 0,1.1; E 0.95,-1.1
ESP-WROOM-32 = smd 0.9 x 1.5: 1 7.7,9; 2 6.43,9; 3 5.16,9; 4 3.89,9; 5 2.62,9; 6 1.35,9; 7 0.08,9; 8 -1.19,9; 9 -2.46,9; 10 -3.73,9; 11 -5,9; 12 -6.27,9; 13 -7.54,9; 14 -8.81,9; 25 -8.81,-9; 26 -7.54,-9; 27 -6.27,-9; 28 -5,-9; 29 -3.73,-9; 30 -2.46,-9; 31 -1.19,-9; 32 0.08,-9; 33 1.35,-9; 34 2.62,-9; 35 3.89,-9; 36 5.16,-9; 37 6.43,-9; 38 7.7,-9 | smd 1.5 x 0.9: 15 -10.3,5.715; 16 -10.3,4.445; 17 -10.3,3.175; 18 -10.3,1.905; 19 -10.3,0.635; 20 -10.3,-0.635; 21 -10.3,-1.905; 22 -10.3,-3.175; 23 -10.3,-4.445; 24 -10.3,-5.715 | smd 6 x 6: GND 0,0
CONV_RKE-0505S/H = drill 1 square: 1 0,0 | drill 1: 2 2.54,0; 5 10.16,0; 7 15.24,0
SMD4-2.54-4.6X6.5MM = smd 1.4 x 1.6: 1 -1.27,-4.68; 2 1.27,-4.68; 3 1.27,4.68; 4 -1.27,4.68
SOT95P280X145-5N = smd 1.39 x 0.6: 1 -1.165,0.95; 2 -1.165,0; 3 -1.165,-0.95; 4 1.165,-0.95; 5 1.165,0.95
SOIC127P600X175-8N = smd 1.9 x 0.6: 1 -2.455,1.905; 2 -2.455,0.635; 3 -2.455,-0.635; 4 -2.455,-1.905; 5 2.455,-1.905; 6 2.455,-0.635; 7 2.455,0.635; 8 2.455,1.905
SOIC254P695X242-4N = smd 1.5 x 0.6: 1 -3.205,1.27; 2 -3.205,-1.27; 3 3.205,-1.27; 4 3.205,1.27
22-23-2021 = drill 1 long: 1 -1.27,0; 2 1.27,0

### Placement (x,y rotation side)
B2  53.98,13.34 180 top
B4  67.94,13.34 180 top
B6  81.92,13.34 180 top
B8  95.89,13.34 180 top
C1  91.43,78.89 270 top
C3  53.98,25.4 0 top
C6  67.94,25.4 0 top
C7  28.19,43.69 0 top
C8  81.92,25.4 0 top
C9  21.84,36.07 180 top
C10  95.89,25.4 0 top
C11  42.16,39.62 270 top
C12  104.14,13.97 180 top
C14  115.57,13.97 180 top
C16  127,13.97 180 top
C18  138.43,13.97 180 top
C19  27.69,61.21 0 top
C20  67.82,63.75 90 top
C21  73.41,63.75 90 top
C22  21.34,53.59 180 top
C23  41.66,57.15 270 top
C27  28.19,77.98 0 top
C28  21.84,70.36 180 top
C29  42.16,73.91 270 top
C33  27.18,95.5 0 top
C34  20.83,87.88 180 top
C35  41.15,91.44 270 top
CLK1  13.97,32 0 bottom
CLK3  13.46,49.53 0 bottom
CLK5  13.97,66.29 0 bottom
CLK7  12.95,83.82 0 bottom
D1  74.93,89.15 90 top
D2  49.53,18.41 270 top
D4  63.5,18.41 270 top
D6  77.47,18.41 270 top
D8  91.44,18.41 270 top
DAT1  16.76,32 0 bottom
DAT3  16.26,49.53 0 bottom
DAT5  16.76,66.29 0 bottom
DAT7  15.75,83.82 0 bottom
GND1  22.61,32 0 bottom
GND3  22.1,49.53 0 bottom
GND5  22.61,66.29 0 bottom
GND14  21.59,83.82 0 bottom
JP4  91.94,89.67 0 top
JP5  91.94,59.19 0 top
JP6  89.35,85.92 90 top
L2  44.96,39.62 90 top
L4  44.45,57.15 90 top
L6  44.96,73.91 90 top
L8  43.94,91.44 90 top
LED2  93.97,85.4 180 top
MCLR1  25.65,32 0 bottom
MCLR3  25.15,49.53 0 bottom
MCLR5  25.65,66.29 0 bottom
MCLR7  24.64,83.82 0 bottom
P2  89.09,69.86 90 top
PGM1  89.08,61.66 270 top
Q3  98.77,75.2 270 top
Q4  98.67,79.4 270 top
R1  78.74,68.58 90 top
R3  127.52,89.96 270 top
R8  103.53,64.97 90 top
R9  99.97,65.08 270 top
R10  95.36,85.4 270 top
R11  95.97,77.3 270 top
R12  95.81,80.91 90 top
R15  14.48,40.89 0 top
R16  50.16,24.13 90 top
R17  53.98,22.86 180 top
R18  50.16,38.1 90 top
R19  14.48,38.35 0 top
R20  18.29,40.89 0 top
R21  18.29,38.35 180 top
R22  64.14,24.13 90 top
R23  67.94,22.86 180 top
R24  64.14,38.1 90 top
R25  27.18,35.31 180 top
R26  42.67,34.04 270 top
R27  44.96,34.04 270 top
R28  78.11,24.13 90 top
R29  81.92,22.86 180 top
R30  78.11,38.1 90 top
R34  92.08,24.13 90 top
R35  95.89,22.86 180 top
R36  92.08,38.1 90 top
R41  13.97,58.42 0 top
R42  108.46,26.67 270 top
R43  108.2,29.97 180 top
R44  105.16,29.97 0 top
R45  109.22,13.97 0 top
R46  106.93,10.92 180 top
R47  13.97,55.88 0 top
R48  17.78,58.42 0 top
R49  17.78,55.88 180 top
R50  26.67,52.83 180 top
R51  42.16,51.56 270 top
R52  119.89,26.67 270 top
R53  119.63,29.97 180 top
R54  116.59,29.97 0 top
R55  120.65,13.97 0 top
R56  118.36,10.92 180 top
R57  44.45,51.56 270 top
R62  131.32,26.67 270 top
R63  131.06,29.97 180 top
R64  128.02,29.97 0 top
R65  132.08,13.97 0 top
R66  129.79,10.92 180 top
R70  14.48,75.18 0 top
R71  14.48,72.64 0 top
R72  142.75,26.67 270 top
R73  142.49,29.97 180 top
R74  139.45,29.97 0 top
R75  143.51,13.97 0 top
R76  141.22,10.92 180 top
R77  18.29,75.18 0 top
R78  18.29,72.64 180 top
R79  27.18,69.6 180 top
R80  42.67,68.33 270 top
R81  44.96,68.33 270 top
R89  13.46,92.71 0 top
R90  13.46,90.17 0 top
R91  17.27,92.71 0 top
R92  17.27,90.17 180 top
R93  26.16,87.12 180 top
R94  41.66,85.85 270 top
R95  43.94,85.85 270 top
RST1  88.77,77.96 90 top
S1  71.12,73.66 270 top
SJ2  19.3,44.45 0 top
SJ4  18.8,61.98 0 top
SJ6  19.3,78.74 0 top
SJ8  18.29,96.27 0 top
SV1  73.66,3.81 0 top
SV2  124.46,5.08 0 top
SV3  5.08,67.31 270 top
T2  105.16,26.92 180 top
T4  116.59,26.92 180 top
T6  128.02,26.92 180 top
T8  139.45,26.92 180 top
U1  117.34,74.43 0 top
U2  41.91,24.13 180 top
U4  53.98,33.02 0 top
U6  67.94,33.02 0 top
U7  21.84,39.62 270 top
U8  81.92,33.02 0 top
U9  27.94,39.62 0 top
U10  95.89,33.02 0 top
U11  35.31,34.04 270 top
U12  106.68,20.32 270 top
U14  118.11,20.32 270 top
U16  129.54,20.32 270 top
U17  70.61,64.26 0 top
U18  140.97,20.32 270 top
U20  21.34,57.15 270 top
U21  27.43,57.15 0 top
U22  34.8,51.56 270 top
U26  21.84,73.91 270 top
U27  27.94,73.91 0 top
U28  35.31,68.33 270 top
U32  20.83,91.44 270 top
U33  26.92,91.44 0 top
U34  34.29,85.85 270 top
VDD1  19.56,32 0 bottom
VDD3  19.05,49.53 0 bottom
VDD5  19.56,66.29 0 bottom
VDD7  18.54,83.82 0 bottom
X1  67.31,87.63 180 top

### Tracks (layer width: path | path; a pad name or v marks a point on that pad's centre or on a via)
3.3V  (via drill 0.51)
  Top 0.152: R36.2 91.91,39.12 | 76.45,38.86 76.54,38.95 | 62.48,38.86 62.57,38.95 | 73.46,62.96 C21.1 | U34.4 38.97,86.8 | U28.4 39.99,69.53 | U22.4 39.22,53.09 | 71.56,62.99 71.56,62.65
  Top 0.305: 81.79,39.12 81.79,35.31 | 67.82,39.37 67.82,35.05 | 54.1,39.37 54.1,35.05
  Top 0.381: 123.77,82.37 U1.2 | R52.2 117.72,23.66 117.72,22.38 116.71,21.37 112.27,25.82 R42.2 110.24,24.04 v110.24,19.3 | 119.89,24.89 125.13,24.89 128.4,21.63 129.41,22.64 129.41,23.91 R62.2 | 131.32,24.89 136.05,24.89 139.45,21.5 141.09,23.15 141.09,24.16 R72.2 | 81.79,35.31 76.45,35.31 76.45,38.86 76.45,39.37 67.82,39.37 | 76.54,38.95 R30.2 | 91.91,39.12 81.79,39.12 | 67.82,35.05 62.48,35.05 62.48,38.86 62.48,39.37 54.1,39.37 | 62.57,38.95 R24.2 | 54.1,35.05 49.02,35.05 49.02,38.7 49.91,38.7 R18.2 54.5,43.29 v54.61,43.18 | S1.4 61.91,70.41 61.91,91.95 63.84,93.88 80.17,93.88 80.17,82.2 79.59,81.62 71.78,81.62 71.78,72.52 81.18,72.52 | 73.46,62.96 77.72,62.96 83.97,69.22 80.92,72.26 81.18,72.52 | 38.97,86.8 36.82,84.66 36.82,72.76 U28.4 | 39.22,61.98 39.22,65.09 37.38,66.93 39.99,69.53 | 39.22,61.98 39.22,53.09 | 39.22,61.98 v36.58,61.98 | U11.4 39.12,36.18 v39.12,37.59 | v64.77,53.09 64.77,55.86 71.56,62.65 | P2.4 82.33,73.67 81.18,72.52 | U14.1 119.38,24.38 | U12.1 107.95,24.38 | 130.81,24.38 U16.1 | 71.56,62.99 U17.2 71.82,62.9
  Top 0.406: 123.77,85.37 U1.2
  Top 0.508: 107.95,24.38 108.46,24.89 R42.2 | 119.38,24.38 119.89,24.89 R52.2 | 130.81,24.38 131.32,24.89 R62.2 | R72.2 142.75,24.89 142.24,24.38 U18.1
  Top 0.635: R8.2 105.02,67.31 108.97,67.31 111.25,69.6 v111.25,73.66 111.25,77.22 114.55,80.52 121.92,80.52 123.77,82.37 | 123.77,85.37 R3.2
  Top 0.762: 71.82,62.9 C21.1
  Bottom 0.381: v36.58,61.98 36.58,53.21 46.61,43.18 v54.61,43.18 | v110.24,19.3 87.63,41.91 62.74,41.91 | v54.61,43.18 62.74,43.18 62.74,41.91 | v39.12,37.59 55.78,37.59 60.2,33.18 62.74,33.18 62.74,41.91 | v64.77,53.09 64.52,53.09 v54.61,43.18
  Bottom 0.635: P2.4 v111.24,73.67 v111.25,73.66
5VA  (via drill 0.51)
  Top 0.152: 25.48,41.83 C7.1 27.34,42.32 26.91,41.88 26.91,39.41 27.96,38.36 31.44,38.36 32.95,39.87 | C27.1 27.34,76.61 26.91,76.17 26.91,73.7 27.97,72.64 33.53,72.64 | 23.46,69.6 R79.2 | 22.95,52.83 R50.2 | 23.46,35.31 R25.2
  Top 0.254: 26.91,76.17 25.54,76.17 25.48,76.12
  Top 0.305: U27.1 23.88,75.82 | U20.5 22.29,55.44 v23.11,54.61
  Top 0.381: 25.48,41.83 U9.1 24,41.53 v23.88,41.4 | C9.1 23.46,35.31 | C9.1 22.69,36.16 v23.62,37.08 23.62,37.63 U7.5 | v23.62,33.78 22.69,34.71 C9.1 | C22.1 22.95,52.83 | U21.1 23.5,59.05 v23.37,58.93 25.65,61.21 C19.1 | v23.11,54.61 22.19,53.68 C22.1 | v21.84,52.32 22.19,52.67 C22.1 | 25.48,76.12 U27.1 | C28.1 23.46,69.6 | 23.88,75.82 v23.88,75.69 | C28.1 22.69,70.45 v23.62,71.37 23.62,71.92 U26.5 | v22.35,69.09 22.69,69.43 C28.1 | C34.1 22.44,87.12 R93.2 25.21,81.55 29.02,81.55 31.78,78.79 31.96,78.79 33.53,77.22 33.53,72.64 | v22.86,93.22 22.99,93.34 U33.1 24.47,93.64 C33.1 | C34.1 21.68,87.97 v22.61,88.9 22.61,89.45 U32.5 | v21.34,86.61 21.68,86.96 C34.1 | R50.2 25.72,52.58 27.34,50.95 27.34,48.94 32.95,43.34 32.95,39.87
  Bottom 0.381: v23.62,37.08 23.88,37.34 v23.88,41.4 | v23.62,33.78 23.11,34.29 21.34,34.29 21.08,34.54 20.83,34.54 19.56,33.27 VDD1.TP 19.56,24.13 U2.7 | v23.11,54.61 23.37,54.86 v23.37,58.93 25.16,58.93 27.14,56.95 28.49,56.95 28.9,57.37 28.9,61 24.88,65.02 20.83,65.02 VDD5.TP v22.35,69.09 | VDD3.TP v21.84,52.32 | v23.62,71.37 23.88,71.63 v23.88,75.69 | v22.61,88.9 22.86,89.15 v22.86,93.22 | VDD7.TP v21.34,86.61
AGND  (via drill 0.51)
  Top 0.152: U7.2 v21.84,42.42
  Top 0.254: v32.51,76.71 32.43,76.63 30.39,76.63
  Top 0.305: v21.34,59.94 U20.2
  Top 0.381: v20.83,89.15 20.07,88.39 20.07,87.97 C34.2 20.07,87.8 20.07,86.61 v21.34,85.34 21.34,82.8 22.99,81.15 | 30.39,76.63 U27.8 | 22.99,81.15 v21.84,80.01 U26.2 | v21.59,71.37 21.08,70.87 21.08,70.45 C28.2 21.08,70.27 21.08,68.58 v22.35,67.31 23.37,66.29 23.37,62.74 26.16,62.74 | U21.8 29.89,59.86 C19.2 28.54,61.63 27.43,62.74 26.16,62.74 | 26.16,62.74 23.37,59.94 v21.34,59.94 | v20.83,54.61 20.57,54.36 20.57,53.68 C22.2 20.57,53.51 20.57,51.82 v21.84,50.55 21.84,48.01 24.64,45.21 | U9.8 30.39,42.34 30.73,42.67 v31.75,42.67 | 24.64,45.21 28.19,45.21 29.04,44.36 C7.2 | v21.84,42.42 24.64,45.21 | v21.34,37.08 21.08,36.83 21.08,36.16 C9.2 21.08,35.98 21.08,34.54 20.07,33.53 20.07,33.27 21.08,32.26 v21.08,30.48 | 22.99,81.15 23.37,80.77 26.67,80.77 29.04,78.4 C27.2 | U32.2 v20.83,95.25 20.83,96.52 22.86,98.55 24.89,98.55 27,96.45 27.06,96.45 27.32,96.19 27.32,96.12 27.94,95.5 C33.2 29.21,95.5 29.38,95.33 U33.8
  Bottom 0.254: v21.84,80.01 23.02,80.01 29.11,73.91 31.75,73.91 32.51,74.68 v32.51,76.71
  Bottom 0.381: v20.83,95.25 v20.83,89.15 | GND14.TP 21.34,84.07 v21.34,85.34 | v21.59,71.37 21.59,80.01 v21.84,80.01 | GND5.TP 22.35,66.55 v22.35,67.31 | v21.34,59.94 20.32,59.94 20.07,59.69 20.07,55.37 v20.83,54.61 | GND3.TP 21.84,49.78 v21.84,50.55 | v21.34,37.08 21.34,41.91 v21.84,42.42 25.25,42.42 28.11,39.56 28.79,39.56 29.27,40.05 29.27,40.19 v31.75,42.67 | v21.08,30.48 21.34,30.48 22.61,31.75 GND1.TP 22.61,26.16 29.72,26.16 U2.5
AI1
  Top 0.152: R89.1 12.36,92.86
  Top 0.254: 1.96,70.92 3.1,69.77 4.26,69.77 5.61,71.12 SV3.2
  Top 0.381: 12.36,92.86 1.96,92.86 1.96,70.92
AI1G
  Top 0.381: SV3.1 3.81,90.17 R90.1
AI2
  Top 0.381: R70.1 6.92,68.58 SV3.4
AI2G
  Top 0.254: SV3.3 4.55,68.58 5.9,67.23 8.12,67.23
  Top 0.381: R71.1 8.12,67.23
AI3
  Top 0.381: R41.1 11.5,59.94 11.5,64.7 10.16,66.04 SV3.6
AI3G
  Top 0.254: SV3.5 5,64.85 6.8,64.85 8.38,63.27
  Top 0.381: 8.38,63.27 8.38,55.88 R47.1
AI4
  Top 0.381: R15.1 6.35,40.89 SV3.8
AI4G
  Top 0.152: 13.27,38.1 R19.1
  Top 0.381: SV3.7 3.81,38.35 4.06,38.1 13.27,38.1
AIN
  Top 0.254: 19.14,38.44 20.32,39.62 22.35,39.62
  Top 0.305: 19.14,38.44 R21.1 | 22.35,39.62 22.79,40.07 U7.1
  Top 0.381: U7.1 22.79,40.71 24.51,38.99 U9.3
AIN_A1
  Top 0.203: 21.84,57.15 19.87,57.15 18.85,56.13 18.63,56.13
  Top 0.305: R49.1 18.63,56.13 | 21.84,57.15 22.29,57.59 U20.1
  Top 0.381: U20.1 22.29,58.23 24,56.52 U21.3
AIN_A2
  Top 0.203: 22.35,73.91 20.57,73.91 19.3,72.64 R78.1
  Top 0.305: 22.35,73.91 22.79,74.36 U26.1
  Top 0.381: U26.1 22.79,75 24.51,73.28 U27.3
AIN_A3
  Top 0.254: R92.1 18.29,90.17 19.56,91.44 21.34,91.44
  Top 0.305: 21.34,91.44 21.78,91.88 U32.1
  Top 0.381: U32.1 21.78,92.52 23.5,90.81 U33.3
DGND  (via drill 0.51)
  Top 0.152: 115.64,29.87 110.47,29.87 109.69,29.09 108.42,29.09 108.18,29.32 108.18,30.66 107.99,30.85 105.37,30.85 105.18,30.66 105.18,28.21 104.52,27.56 | R54.1 115.84,29.87 116.61,30.64 116.61,30.66 116.8,30.85 119.42,30.85 119.61,30.66 119.61,29.32 119.85,29.09 121.12,29.09 121.9,29.87 127.07,29.87 127.25,29.87 128.23,30.85 130.85,30.85 131.04,30.66 131.04,29.32 131.28,29.09 132.55,29.09 133.33,29.87 138.5,29.87 | 97.49,38.03 U10.3 | U2.2 39.37,31.68 39.32,31.74 39.05,31.74 38.86,31.93 38.86,33.6 39.05,33.8 41.48,33.8 R26.1 | 41.91,52.51 R51.1 | 46.95,64.81 46.7,64.56 | 78.67,67.56 R1.1 | 71.88,37.59 71.77,37.7 | C20.2 67.65,64.77 | JP4.1 93.13,88.48 93.13,85.61 93.32,85.42 94.61,85.42 94.81,85.61 94.81,85.7 R10.1 97.14,86.25 98.33,85.07 102.12,85.07 U1.15 104.46,80.14 102.89,78.57 98.93,78.57 98.6,78.91 98.6,80.99 97,82.59 93.66,82.59 93.66,78.04 C1.2 | 122.64,79.87 122.7,79.87 | 125.04,66.23 U1.38
  Top 0.254: 37.59,51.58 40.97,51.58 41.91,52.51 | 119.27,72.5 v119.27,72 | 118.47,73.3 118.27,73.5 v119.27,73.5 | 119.27,76.36 v119.27,76.5 | 115.7,74.43 v115.57,74.3 | 115.34,74.43 v114.77,75 | v115.57,75.7 | 117.34,75.43 v117.07,75.7 | 117.34,76.07 v117.77,76.5 | v114.77,76.5 v114.77,76.49 | 116.27,75.5 v116.27,76.5
  Top 0.305: 45.34,91.52 42.86,91.52 42.86,88.01 R94.1
  Top 0.381: R26.1 42.67,38.27 C11.2 41.84,38.77 39.04,41.58 | R51.1 42.16,55.79 C23.2 40.13,57.82 40.13,61.47 43.61,61.47 46.95,64.81 49.49,67.35 49.49,79.72 48.04,81.17 47.56,81.17 | R80.1 42.67,72.56 C29.2 39.81,75.42 39.81,80.16 46.55,80.16 47.56,81.17 | R94.1 41.66,90.08 C35.2 | 99.81,34.27 104.21,29.87 R44.1 | 99.81,34.27 99.13,34.95 99.13,38.03 97.49,38.03 | C21.2 75.71,64.6 78.67,67.56 v74.93,67.56 | 39.04,41.58 37.59,43.03 37.59,51.58 | 45.34,91.52 47.56,89.3 47.56,81.17 | R9.1 100.84,66.8 v100.84,67.06 | 39.04,41.58 39.88,42.42 v39.88,43.94 | U4.3 57.04,37.7 v60.45,34.29 71.88,34.29 | 71.88,34.29 71.88,37.59 | 71.77,37.7 U6.3 | 71.88,34.29 72.9,33.27 83.19,33.27 U8.3 88.63,32.26 97.79,32.26 99.81,34.27 | 67.65,64.77 57.91,64.77 v57.4,64.26 | v51.05,64.01 50.51,64.56 46.7,64.56 | PGM1.1 90.51,65.09 90.51,69.83 89.22,71.13 P2.3 89.47,71.13 91.54,73.19 RST1.1 | v119.27,76.5 122.64,79.87 | 122.7,79.87 125.04,82.21 U1.1 | v119.27,72 125.04,66.23 | T2.E 104.52,27.71 104.52,27.56 | R74.1 138.5,29.87 | 118.47,73.3 v118.47,72.8 | R64.1 127.17,29.95 127.25,29.87 | R54.1 115.64,29.87
  Top 0.635: T2.E 104.21,29.87 | T4.E 115.64,29.87 | T6.E 127.07,29.87 | T8.E 138.5,29.87
  Top 0.762: C21.2 72.65,65.36 U17.3 68.58,65.36 C20.2
  Bottom 0.152: v118.49,75.72 117.77,76.44 v117.77,76.5 | v119.27,76.5 v119.27,75
  Bottom 0.305: v114.77,72 v115.57,72.8 | v115.57,72.8 114.87,73.5 v114.77,73.5 | v115.57,72.8 116.27,72.1 v116.27,72 | v115.57,72.8 v116.27,73.5 | v116.27,73.5 116.27,73.6 v115.57,74.3 | v116.27,73.5 116.97,72.8 v117.07,72.8 117.77,72.1 v117.77,72 118.47,72.7 v118.47,72.8 | v118.47,72.8 v119.27,72 | v118.47,72.8 v117.77,73.5 | v117.77,73.5 v118.47,74.2 | v117.07,75.7 116.37,75 v116.27,75 | v115.57,75.7 v116.27,75 | v115.57,75.7 v114.77,76.5 | v115.57,75.7 116.27,76.4 v116.27,76.5 | v117.07,75.7 117.77,76.4 v117.77,76.5 | v118.47,74.2 v119.27,75 | v118.47,74.2 119.17,73.5 v119.27,73.5 | v114.77,75 115.47,74.3 v115.57,74.3 | 117.67,73.5 v117.77,73.5 | v117.07,75.7 v117.77,75 v116.97,74.2 | v116.27,75 v115.57,74.3 | v116.27,73.5 v116.97,74.2 | v116.97,74.2 116.27,74.9 v116.27,75
  Bottom 0.381: X1.1 68.58,80.77 66.29,80.77 66.29,67.56 v74.93,67.56 85.53,67.56 P2.3 93.16,67.06 v100.84,67.06 | v39.88,43.94 44,43.94 46.82,41.12 53.62,41.12 v60.45,34.29 | v57.4,64.26 51.31,64.26 v51.05,64.01 | v100.84,67.06 95.39,72.5 89.74,72.5 89.62,72.39 88.56,72.39 87.81,73.14 87.81,74.2 90.23,76.62 97.89,76.62 98.39,77.12 98.39,83.22 JP4.1 | v100.84,67.06 103.14,67.06 105.59,64.61 111.6,64.61 114.77,67.78 v114.77,72
  pour Bottom (isolate 0.406): 113.87,77.2 113.87,71.2 119.87,71.2 119.87,77.2
  pour Bottom (isolate 0.406): 114.47,77.2 114.47,71.2 120.47,71.2 120.47,77.2
  pour Bottom (isolate 0.254): 38.1,21.59 45.72,21.59 45.72,35.56 125.22,35.56 125.22,99.06 38.1,99.06
  pour Top: 38.1,21.59 45.72,21.59 45.72,35.56 125.22,35.56 125.22,99.06 38.1,99.06
DI1
  Top 0.152: 97.03,10.34 B8.AC1
  Top 0.381: SV1.8 97.03,5.08 97.03,10.34
DI1G
  Top 0.254: 86.36,6.6 76.12,6.6 76.12,3.89 SV1.7
  Top 0.381: B8.AC2 86.68,10.48 86.36,10.16 86.36,6.6
DI2
  Top 0.152: SV1.6 74.78,5.23
  Top 0.381: 74.78,5.23 74.78,8.53 81.81,8.53 83.19,9.92 B6.AC1
DI2G
  Top 0.152: B6.AC2 80.57,10.41
  Top 0.254: 73.91,10.41 73.91,5.86 73.58,5.53 73.58,3.89 SV1.5
  Top 0.381: 80.57,10.41 73.91,10.41
DI3
  Top 0.381: B4.AC1 70.55,10.48 72.39,8.64 SV1.4
DI3G
  Top 0.254: SV1.3 71.2,3.73 71.2,7.19
  Top 0.381: B4.AC2 66.67,8.27 67.74,7.19 71.2,7.19
DI4
  Top 0.381: SV1.2 60.66,5.08 B2.AC1
DI4G
  Top 0.381: B2.AC2 60.63,2.54 SV1.1
DO1
  Top 0.152: 107.78,10.67 R46.1
  Top 0.381: 107.78,10.67 107.78,6.35 SV2.2 | 110.74,16.26 110.74,14.09 R45.2
  Top 0.762: U12.4 109.89,17.11 110.74,16.26 110.74,11.43 110.24,10.92 R46.1
DO1G
  Top 0.381: R46.2 105.83,4.06 120.4,4.06 SV2.1
  Top 0.762: U12.3 103.98,17.11 103.19,16.32 C12.2 103.19,11.87 104.14,10.92 R46.2
DO2
  Top 0.381: SV2.4 123.19,7.11 119.46,10.84 R56.1 | 122.17,16.26 122.17,14.09 R55.2
  Top 0.762: U14.4 121.31,17.11 122.17,16.26 122.17,11.43 121.67,10.92 R56.1
DO2G
  Top 0.254: 121.1,7.7 121.92,6.88 121.92,3.81 SV2.3
  Top 0.305: 120.49,7.7 121.1,7.7
  Top 0.381: R56.2 120.49,7.7
  Top 0.762: U14.3 115.41,17.11 114.62,16.32 C14.2 114.62,11.87 115.57,10.92 R56.2
DO3
  Top 0.381: R66.1 129.37,9.4 127,9.4 125.73,8.13 SV2.6 | 133.6,16.26 133.6,14.09 R65.2
  Top 0.762: U16.4 132.75,17.11 133.6,16.26 133.6,11.43 133.1,10.92 R66.1
DO3G
  Top 0.254: 124.46,8.38 124.46,3.81 SV2.5
  Top 0.381: 127,10.92 124.46,8.38
  Top 0.762: U16.3 126.84,17.11 126.05,16.32 C16.2 126.05,11.87 127,10.92 R66.2
DO4
  Top 0.381: R76.1 137.75,6.35 SV2.8 | R75.2 144.91,16.13 145.03,16.26
  Top 0.762: U18.4 144.18,17.11 145.03,16.26 145.03,11.43 144.53,10.92 R76.1
DO4G
  Top 0.254: 126.88,7.98 126.88,4.44
  Top 0.305: SV2.7 127.51,3.81 126.88,4.44
  Top 0.381: 126.88,7.98 129.28,7.98 129.69,8.38 138.68,8.38 140.12,9.82 R76.2
  Top 0.762: U18.3 138.27,17.11 137.48,16.32 C18.2 137.48,11.87 138.43,10.92 R76.2
DTR  (via drill 0.51)
  Top 0.406: R12.1 94.54,80.06 94.49,80.01 v94.49,79.25 94.23,78.99 94.23,76.2 96.18,74.25 Q3.2
  Bottom 0.406: JP6.1 94.49,79.52 v94.49,79.25
EN  (via drill 0.51)
  Top 0.254: 99.82,82.04 v103.38,82.04
  Top 0.305: U1.3 122.5,83.8 122.27,84
  Top 0.406: C1.1 91.43,79.96 91.43,82.79 91.95,83.31 98.55,83.31 99.82,82.04 99.82,79.46 Q4.3 | 122.27,84 122.27,87.8 122.77,88.2 123.49,88.2 JP4.14 125.48,89.67 126.63,90.81 R3.1
  Top 0.61: RST1.2 91.43,79.96
  Bottom 0.254: v103.38,82.04 105.92,82.04 105.92,82.77 104.43,84.26 104.43,84.95 107.83,88.35 122.97,88.35 124.29,89.67 JP4.14
ICSPCLK  (via drill 0.51)
  Top 0.381: v28.45,42.16 27.43,41.15 27.43,39.62 27.81,39.24 30.14,39.24 U9.6
  Bottom 0.381: CLK1.TP 18.77,36.8 18.77,43.16 21.04,45.42 25.69,45.42 28.45,42.66 v28.45,42.16
ICSPCLK_A1  (via drill 0.51)
  Top 0.381: v27.69,59.69 26.92,58.93 26.92,57.15 27.56,56.52 U21.6
  Bottom 0.381: CLK3.TP 16.48,52.55 16.48,64.22 22.64,64.22 27.17,59.69 v27.69,59.69
ICSPCLK_A2  (via drill 0.51)
  Top 0.381: U27.6 28.07,73.28 27.43,73.91 27.43,75.44 28.45,76.45 28.45,76.71 29.72,76.71 29.76,76.75 29.76,76.89 30.13,77.26 30.27,77.26 30.48,77.47 v30.48,77.72
  Bottom 0.381: CLK5.TP 18.52,70.84 18.52,82.51 26.2,82.51 30.48,78.22 v30.48,77.72
ICSPCLK_A3  (via drill 0.51)
  Top 0.381: v27.18,93.98 26.42,93.22 26.42,91.44 27.05,90.81 U33.6
  Bottom 0.381: CLK7.TP 16.74,87.61 16.74,95.99 19.26,98.51 24.67,98.51 27.18,96 v27.18,93.98
ICSPDAT  (via drill 0.51)
  Top 0.381: U9.7 28.7,40.26 28.7,40.39 v28.45,40.64 | v21.84,44.45 SJ2.2
  Bottom 0.381: v28.45,40.64 28.45,40.89 24.89,44.45 v21.84,44.45 21.59,44.45 20.32,43.18 20.32,35.56 DAT1.TP
ICSPDAT_A1  (via drill 0.51)
  Top 0.381: U21.7 28.07,57.78 v27.94,57.91
  Top 0.508: v21.34,63.25 20.83,63.25 SJ4.2
  Bottom 0.381: v27.94,57.91 22.61,63.25 v21.34,63.25 17.78,63.25 17.78,51.05 DAT3.TP
ICSPDAT_A2  (via drill 0.51)
  Top 0.381: U27.7 29.59,74.55 v28.7,75.44 | v21.08,81.53 20.83,81.28 20.83,79.5 SJ6.2
  Bottom 0.381: v28.7,75.44 28.7,76.2 23.37,81.53 v21.08,81.53 20.07,80.52 20.07,69.6 DAT5.TP
ICSPDAT_A3  (via drill 0.51)
  Top 0.381: U33.7 27.56,92.08 v27.43,92.2 | v20.32,97.54 SJ8.2
  Bottom 0.381: v27.43,92.2 22.1,97.54 v20.32,97.54 18.29,95.5 18.29,86.36 DAT7.TP
IO0  (via drill 0.51)
  Top 0.381: v106.14,66.08 106.78,65.43
  Top 0.406: 106.78,65.43 U1.25 | v106.14,66.08 104.06,64 103.65,64 | JP5.3 101.83,64 103.65,64 | Q3.3 103.63,71.44 v103.63,71.37 | v90.57,61.1 89.13,59.66 | 103.65,64 R8.1
  Top 0.635: 89.13,59.66 PGM1.2
  Bottom 0.406: JP5.3 96.98,59.09 95.07,61 v90.57,61.1 | v103.63,71.37 103.63,68.58 v106.14,66.08
IO2
  Top 0.406: U1.24 104.02,68.72 101.35,66.04 101.35,65.02 100.55,64.23 R9.2 99.52,64.23 JP5.2
IO4
  Top 0.406: U1.26 109.8,64.43 109.37,64 106.37,64 105.07,62.7 103.07,62.7 JP5.4
IO5
  Top 0.406: U1.29 113.61,63.64 111.57,61.6 110.97,61.6 110.27,60.9 108.89,60.9 JP5.7
IO12
  Top 0.381: JP4.3 97.02,93.22 81.79,93.22 81.79,76.71 74.17,76.71 73.97,76.91 S1.1
  Top 0.406: U1.14 108.53,84.54 108.17,84.9 107.27,84.9 106.47,85.7 104.67,85.7 103.87,86.5 102.87,86.5 102.17,87.2 99.49,87.2 JP4.3
IO13  (via drill 0.51)
  Top 0.406: U1.16 108.74,78.88 v108.77,78.9 | v105.27,84.6 104.37,84.6 103.37,85.6 102.27,85.6 101.57,86.3 97.85,86.3 JP4.2 93.98,88.91 93.97,88.9 LED2.A
  Bottom 0.406: v108.77,78.9 108.77,81.1 v105.27,84.6
IO14
  Top 0.381: JP4.4 99.56,94.75 61.21,94.75 53.34,86.88 53.34,50.29 44.96,41.91 L2.2 44.81,40.47 C11.1
  Top 0.406: U1.13 109.8,83.73 109.97,83.9 109.97,84.9 109.17,85.7 107.67,85.7 106.77,86.6 105.27,86.6 104.47,87.4 103.27,87.4 102.57,88.1 101.13,88.1 JP4.4
IO15
  Top 0.406: U1.23 102.33,69.98 91.94,59.6 JP5.1
IO16
  Top 0.406: U1.27 111.07,64.4 109.87,63.2 107.17,63.2 105.47,61.5 104.41,61.5 JP5.5
IO17
  Top 0.406: U1.28 112.34,64.07 110.77,62.5 110.37,62.5 109.77,61.9 107.35,61.9 JP5.6
IO18
  Top 0.406: U1.30 114.88,63.51 112.07,60.7 111.23,60.7 JP5.8
IO19
  Top 0.61: U1.31 116.15,63.08 JP5.9
IO21
  Top 0.61: U1.33 118.69,63.08 JP5.10
IO22  (via drill 0.51)
  Top 0.152: 122.5,59.27 122.5,59.19 JP5.13 | 37.87,34.2 41.31,34.2 41.31,37.09
  Top 0.305: 122.5,59.02 111.74,48.26 55.12,48.26 47.21,40.35
  Top 0.381: C29.1 44.81,74.76 L6.2 46.55,74.91 46.55,65.42 44.66,65.42 43.5,64.26 v42.67,64.26 | 37.87,34.2 36.25,32.59 36.25,24.7 39.17,21.78 43.82,21.78 47.21,25.17 47.21,40.35 | 41.31,37.09 35.31,43.1 v35.31,45.47
  Top 0.61: 122.5,59.02 122.5,59.27 U1.36
  Bottom 0.381: v35.31,45.47 35.31,61.98 36.2,62.88 41.29,62.88 v42.67,64.26
IO23
  Top 0.152: JP5.14
  Top 0.305: 56.44,47.3 124.97,47.3 JP5.14
  Top 0.381: L8.2 43.79,92.29 C35.1 34.38,92.29 34.38,24.47 38.5,20.35 43.73,20.35 47.87,24.49 47.87,38.72 56.44,47.3
  Top 0.61: U1.37 123.77,60.38 JP5.14
IO25  (via drill 0.51)
  Top 0.381: R63.1 131.91,32 128.87,35.05 109.73,35.05 109.47,34.8 v108.71,34.8
  Top 0.406: U1.10 113.61,84.66 110.17,88.1 108.75,88.1 JP4.7
  Bottom 0.305: v108.71,34.8 108.05,35.46 106.83,35.46 106.32,35.96 106.32,36.37 81.79,60.91 63.55,60.91 63.45,61.01 63.45,92.43 63.52,92.51 103.71,92.51 106.54,89.67 JP4.7
IO26  (via drill 0.51)
  Top 0.381: R73.1 136.99,36.32 v107.19,36.32
  Top 0.406: U1.11 112.34,83.67 112.57,83.9 112.57,84.6 109.87,87.3 108.47,87.3 107.57,88.2 106.11,88.2 JP4.6
  Bottom 0.305: v107.19,36.32 82.04,61.47 64.01,61.47 64.01,91.95 102.36,91.95 JP4.6
IO27
  Top 0.381: C23.1 44.3,58 L4.2 50.29,58.15 52.43,60.28 52.43,89.08 59.01,95.66 100.82,95.66 102.1,94.38 JP4.5
  Top 0.406: U1.12 111.07,83.9 111.17,84 111.17,84.8 109.47,86.5 108.07,86.5 107.17,87.4 105.67,87.4 104.87,88.2 103.57,88.2 JP4.5
IO32  (via drill 0.51)
  Top 0.152: v108.97,32.51 108.97,30.06 R43.1
  Top 0.61: U1.8 116.15,85.78 JP4.9
  Bottom 0.305: v108.97,32.51 108.2,32.51 105.21,35.5 105.21,35.87 81.28,59.79 62.86,59.79 62.33,60.32 62.33,93.45 62.66,93.78 107.52,93.78 111.62,89.67 JP4.9
IO33  (via drill 0.51)
  Top 0.381: R53.1 122.68,32.17 122.68,33.53 122.43,33.78 110.74,33.78 v110.49,34.04
  Top 0.61: U1.9 114.88,85.39 112.17,88.1 111.29,88.1 JP4.8
  Bottom 0.305: v110.49,34.04 109.17,34.04 109.07,33.93 107.56,33.93 105.77,35.73 105.77,36.12 81.53,60.35 63.09,60.35 62.89,60.55 62.89,93.22 106.17,93.22 JP4.8
IO34  (via drill 0.51)
  Top 0.305: 80.64,41.91 82.68,43.94 v90.93,43.94
  Top 0.381: 80.64,41.91 U8.4 80.19,37.25
  Top 0.508: 80.19,37.25 R30.1
  Top 0.61: U1.6 118.69,88.32 JP4.11
  Bottom 0.305: JP4.11 116.7,89.67 111.48,94.89 62.2,94.89 61.21,93.91 61.21,59.86 62.4,58.67 80.24,58.67 90.93,47.98 v90.93,43.94
IO35  (via drill 0.51)
  Top 0.381: v99.57,39.37 99.57,39.02 94.66,39.02 94.66,37.75 U10.4 92.53,37.7 R36.1
  Top 0.61: U1.7 117.42,87.05 JP4.10
  Bottom 0.305: v99.57,39.37 99.57,40.39 80.72,59.23 62.63,59.23 61.77,60.09 61.77,93.68 62.43,94.34 109.5,94.34 114.16,89.67 JP4.10
IO36  (via drill 0.51)
  Top 0.152: U4.4 52.68,37.73
  Top 0.305: 60.03,45.36 60.13,45.47
  Top 0.381: 52.68,37.73 52.68,39.28 58.76,45.36 60.03,45.36 | 60.13,45.47 v62.23,45.47 | U4.4 52.26,37.25
  Top 0.508: 52.26,37.25 R18.1
  Top 0.61: U1.4 121.23,88.48 JP4.13
  Bottom 0.305: v62.23,45.47 68.83,52.07 85.06,52.07 79.58,57.56 61.94,57.56 60.1,59.4 60.1,94.38 61.73,96.01 115.44,96.01 121.78,89.67 JP4.13
IO39  (via drill 0.51)
  Top 0.152: U6.4 66.91,37.7
  Top 0.381: 66.91,37.7 66.91,43.18 67.67,43.94 v68.83,43.94 | U6.4 66.22,37.25
  Top 0.406: 119.96,89.59 JP4.12
  Top 0.508: 66.22,37.25 R24.1
  Top 0.61: U1.5 119.96,89.59
  Bottom 0.305: v68.83,43.94 77.72,43.94 85.85,52.07 79.81,58.12 62.17,58.12 60.66,59.63 60.66,94.14 61.97,95.45 113.46,95.45 119.24,89.67 JP4.12
LED  (via drill 0.51)
  Top 0.381: U9.5 29.08,37.72 v28.96,37.59 | v28.7,32.77 U11.2
  Bottom 0.381: v28.96,37.59 28.7,37.34 v28.7,32.77
LED_A1  (via drill 0.51)
  Top 0.381: U21.5 28.57,55.24 v28.45,55.12 | v28.7,50.29 U22.2
  Bottom 0.381: v28.45,55.12 28.19,54.86 28.19,50.8 v28.7,50.29
LED_A2  (via drill 0.51)
  Top 0.381: U27.5 29.08,72.01 v28.96,71.88 | v29.21,67.06 U28.2
  Bottom 0.381: v28.96,71.88 28.7,71.63 28.7,67.56 v29.21,67.06
LED_A3  (via drill 0.51)
  Top 0.381: U33.5 28.07,89.53 v27.94,89.41 | v28.19,84.58 U34.2
  Bottom 0.381: v27.94,89.41 27.69,89.15 27.69,85.09 v28.19,84.58
MCLR  (via drill 0.51)
  Top 0.381: U9.4 24.64,36.87 v24.64,36.58
  Bottom 0.381: v24.64,36.58 24.64,33.02 MCLR1.TP
MCLR_A1  (via drill 0.51)
  Top 0.381: U21.4 24.13,54.4 v24.13,54.1
  Bottom 0.381: v24.13,54.1 24.13,50.55 MCLR3.TP
MCLR_A2  (via drill 0.51)
  Top 0.381: U27.4 24.64,71.16 v24.64,70.87
  Bottom 0.381: v24.64,70.87 24.64,67.31 MCLR5.TP
MCLR_A3  (via drill 0.51)
  Top 0.381: U33.4 23.62,88.69 v23.62,88.39
  Bottom 0.381: v23.62,88.39 23.62,84.84 MCLR7.TP
N$1
  Top 0.406: LED2.C R10.2
N$2
  Top 0.381: D1.A 66.04,91.35 X1.2
N$5
  Top 0.406: R11.2 97.37,76.45 Q3.1
N$6
  Top 0.406: R12.2 96.41,81.76 97.57,80.61 Q4.1
N$11
  Top 0.381: S1.2 74.26,69.53 R1.2
N$14
  Top 0.203: U7.3 20.64,40.79 19.73,39.88 18.03,39.88 17.44,40.47 R20.1
  Top 0.635: R15.2 R20.1
N$15
  Top 0.381: U4.1 53.02,28.02 | R16.2 50.48,25.4
  Top 0.762: 50.48,25.4 C3.1 | 53.02,28.02 C3.1 | R17.2 C3.1
N$16  (via drill 0.51)
  Top 0.381: R17.1 55.37,22.41 v55.37,20.07 | v52.58,18.03 52.7,17.92 B2.-
  Top 0.762: U4.2 55.24,26.67 54.92,26.35 C3.2 R17.1 | B2.- 49.76,16.19 D2.A
  Bottom 0.381: v55.37,20.07 54.61,20.07 v52.58,18.03
  pour Top (isolate 0.254): 47.62,29.21 59.05,29.21 59.05,13.34 47.62,13.34
  pour Bottom (isolate 0.254): 47.62,13.34 47.62,29.21 59.05,29.21 59.05,13.34
N$17
  Top 0.762: R16.1 50.16,21.05 D2.C 51.98,20.41 55.26,17.14 B2.+
N$18
  Top 0.305: U7.4 20.07,37.63 20.07,37.08 19.56,36.58 18.29,36.58 17.44,37.43 R21.2
  Top 0.635: R19.2 R21.2
N$19
  Top 0.635: R20.2 19.14,42.08 18.54,42.67 SJ2.1
N$20
  Top 0.381: R25.1 U11.1
N$21
  Top 0.381: U11.3 42.35,32.77 R26.2 R27.2
N$24
  Top 0.381: L2.1 R27.1
N$31
  Top 0.254: U6.1 67,28.02
  Top 0.381: R22.2 64.45,25.4
  Top 0.762: 64.45,25.4 C6.1 | R23.2 C6.1 | 67,28.02 C6.1
N$32  (via drill 0.51)
  Top 0.152: R23.1 68.89,22.8
  Top 0.381: v69.34,19.56 69.34,22.35 68.89,22.8 | v66.55,18.03 66.55,16.31 B4.-
  Top 0.762: U6.2 69.22,26.67 68.89,26.35 C6.2 R23.1 | B4.- 63.73,16.19 D4.A
  Bottom 0.381: v69.34,19.56 68.07,19.56 v66.55,18.03
  pour Top (isolate 0.254): 61.59,29.21 73.03,29.21 73.03,13.34 61.59,13.34
  pour Bottom (isolate 0.254): 61.59,13.34 61.59,29.21 73.03,29.21 73.03,13.34
N$33
  Top 0.762: R22.1 64.14,21.05 D4.C 65.94,20.41 69.22,17.14 B4.+
N$40
  Top 0.203: U20.3 19.6,57.53 19.4,57.53 19.27,57.4 17.53,57.4 16.93,58 R48.1
  Top 0.635: R41.2 R48.1
N$41
  Top 0.305: U20.4 19.56,55.16 19.56,54.61 19.05,54.1 17.78,54.1 16.93,54.95 R49.2
  Top 0.635: R47.2 R49.2
N$42
  Top 0.635: R48.2 18.63,59.6 18.03,60.2 SJ4.1
N$43
  Top 0.381: R50.1 U22.1
N$44
  Top 0.381: U22.3 41.84,50.29 R51.2 R57.2
N$45
  Top 0.381: U2.1 46.55,28.77 46.55,41.21 67.82,62.48 C20.1 | C20.1 55.37,62.9 55.37,67.82 69.85,67.82 70.87,68.83 70.87,82.8 75.18,82.8 75.18,86.7 D1.C | C20.1 68.08,63.16
  Top 0.762: 68.08,63.16 U17.1
N$47
  Top 0.381: U8.1 80.97,28.02 | R28.2 78.42,25.4
  Top 0.762: 78.42,25.4 C8.1 | 80.97,28.02 C8.1 | R29.2 C8.1
N$48  (via drill 0.51)
  Top 0.381: R29.1 84.07,21.65 v84.07,20.32 | v80.52,17.78 80.64,17.66 B6.-
  Top 0.762: U8.2 83.19,26.67 82.86,26.35 C8.2 R29.1 | B6.- 77.69,16.19 D6.A
  Bottom 0.381: v84.07,20.32 81.53,17.78 v80.52,17.78
  pour Top (isolate 0.254): 75.56,29.21 87,29.21 87,13.34 75.56,13.34
  pour Bottom (isolate 0.254): 75.56,13.34 75.56,29.21 87,29.21 87,13.34
N$49
  Top 0.762: R28.1 78.11,21.05 D6.C 79.92,20.41 83.19,17.14 B6.+
N$53
  Top 0.381: L4.1 R57.1
N$63
  Top 0.381: U10.1 94.94,28.02 | R34.2 92.39,25.4
  Top 0.762: 92.39,25.4 C10.1 | 94.94,28.02 C10.1 | R35.2 C10.1
N$64  (via drill 0.51)
  Top 0.152: 94.49,16.31 B8.-
  Top 0.381: R35.1 97.28,22.41 v97.28,20.07 | v94.49,18.03 94.49,16.31
  Top 0.762: U10.2 97.16,26.67 96.83,26.35 C10.2 R35.1 | B8.- 91.67,16.19 D8.A
  Bottom 0.381: v97.28,20.07 95.25,18.03 v94.49,18.03
  pour Top (isolate 0.254): 89.53,29.21 100.97,29.21 100.97,13.34 89.53,13.34
  pour Bottom (isolate 0.254): 89.53,13.34 89.53,29.21 100.97,29.21 100.97,13.34
N$65
  Top 0.762: R34.1 92.08,21.05 D8.C 93.89,20.41 97.17,17.14 B8.+
N$69
  Top 0.203: U26.3 20.11,74.3 19.91,74.3 19.78,74.17 18.03,74.17 17.44,74.76 R77.1
  Top 0.635: R70.2 R77.1
N$70
  Top 0.305: U26.4 20.07,71.92 20.07,71.37 19.56,70.87 18.29,70.87 17.44,71.72 R78.2
  Top 0.635: R71.2 R78.2
N$71
  Top 0.635: R77.2 19.14,76.37 18.54,76.96 SJ6.1
N$72
  Top 0.381: R79.1 U28.1
N$73
  Top 0.381: U28.3 42.35,67.06 R80.2 R81.2
N$76
  Top 0.381: L6.1 R81.1
N$80
  Top 0.305: 105.49,26.16 106.68,26.16 108.04,27.52 R42.1
  Top 0.381: 105.49,26.16 T2.C 105.41,25.57
  Top 0.508: 105.41,25.57 U12.2
N$81
  Top 0.381: R43.2 R44.2 106.11,29.87
  Top 0.635: 106.11,29.87 T2.B
N$85
  Top 0.762: C12.1 R45.1
N$92
  Top 0.203: U32.3 18.97,91.69 17.02,91.69 16.42,92.29 R91.1
  Top 0.635: R89.2 R91.1
N$93
  Top 0.305: U32.4 19.05,89.45 19.05,88.9 18.54,88.39 17.27,88.39 16.42,89.24 R92.2
  Top 0.635: R90.2 R92.2
N$94
  Top 0.635: R91.2 18.12,93.89 17.53,94.49 SJ8.1
N$95
  Top 0.381: R93.1 U34.1
N$96
  Top 0.305: 116.92,26.16 118.11,26.16 119.47,27.52 R52.1
  Top 0.381: 116.84,25.57 T4.C 116.92,26.16
  Top 0.508: 116.84,25.57 U14.2
N$97
  Top 0.254: R54.2 R53.2
  Top 0.381: R54.2 117.54,29.87
  Top 0.635: 117.54,29.87 T4.B
N$98
  Top 0.381: U34.3 41.34,84.58 R94.2 R95.2
N$101
  Top 0.762: C14.1 R55.1
N$104
  Top 0.381: L8.1 R95.1
N$112
  Top 0.305: R62.1 130.9,27.52 129.03,25.65
  Top 0.381: 129.03,25.65 128.19,25.65 | 128.19,25.65 T6.C | U16.2 128.27,25.57 128.19,25.65
N$113
  Top 0.381: R63.2 129.07,29.97 128.97,29.87 R64.2
  Top 0.635: 128.97,29.87 T6.B
N$117
  Top 0.762: C16.1 R65.1
N$128
  Top 0.305: 139.78,26.16 140.97,26.16 142.33,27.52 R72.1
  Top 0.381: 139.78,26.16 T8.C 139.7,25.57
  Top 0.508: 139.7,25.57 U18.2
N$129
  Top 0.381: 140.4,29.87 R74.2 R73.2
  Top 0.635: 140.4,29.87 T8.B
N$133
  Top 0.762: C18.1 R75.1
RTS  (via drill 0.51)
  Top 0.406: R11.1 97.27,78.15 Q4.2 97.54,78.42 v97.54,77.47
  Bottom 0.406: JP6.2 97.54,79.01 v97.54,77.47
RXD0
  Top 0.305: JP5.11 117.34,59.17
  Top 0.406: 117.34,59.17 115.87,57.7 88.67,57.7 87.77,58.6 87.77,64.72 P2.1
  Top 0.61: U1.34 119.96,61.81 JP5.11
TXD0
  Top 0.406: 119.47,58.8 119.49,58.8 JP5.12
  Top 0.61: U1.35 121.23,60.56 119.47,58.8
  Bottom 0.305: JP5.12 119.86,59.19
  Bottom 0.406: 119.86,59.19 118.21,57.55 88.82,57.55 87.77,58.6 87.77,67.26 P2.2

### Text on the board
tNames: EN | GD | 27 | 26 | 25 | 33 | 32 | 35 | 34 | 39 | 36 | GD | 13 | 12 | 14 | En | VIN | + | 3V3 | GD | TX | RX | 18 | 19 | 21 | 3R | 1T | 22 | 23 | 15 | 2 | 0 | 4 | 16 | 17 | 5
bNames: GD | GD | 13 | 12 | 14 | EN | En | 27 | 26 | 25 | 33 | 32 | 35 | 34 | 39 | 36 | VIN | 3V3 | GD | TX | RX | 15 | 16 | 17 | 2 | 0 | 4 | 5 | 18 | 19 | 21 | 3R | 1T | 22 | 23